# EAGLE design Kintex7_disp_inout_hdmi (EAGLE 7.6.0)

## Sheet 1 of 3
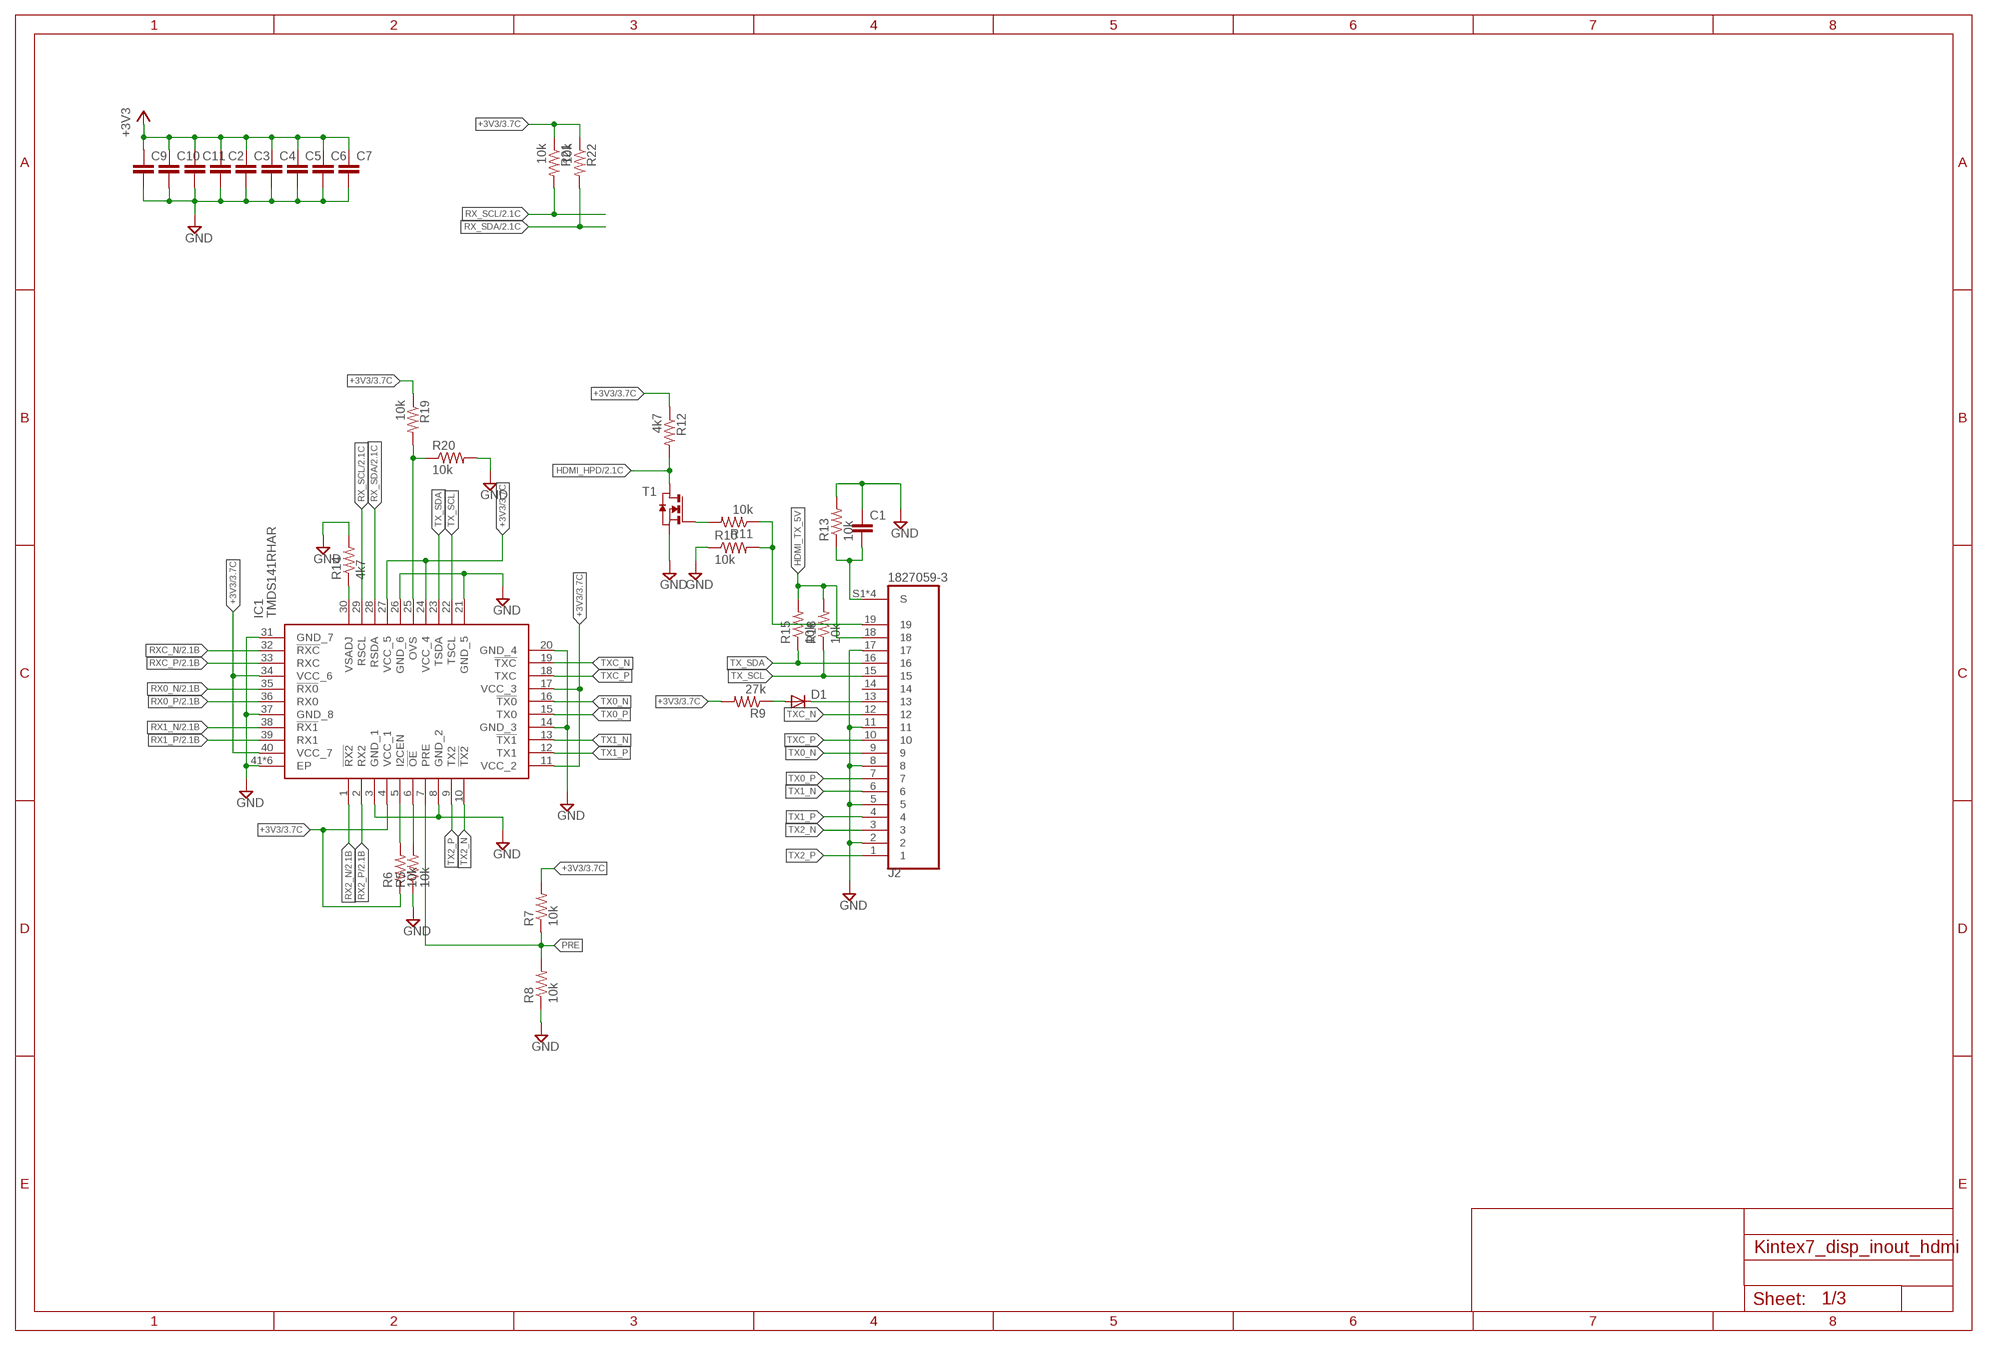
[diagram p0: schematic, sheet 1]

### Parts
C1  C-EUC0603  [C0603]
C2  C-EUC0603  [C0603]
C3  C-EUC0603  [C0603]
C4  C-EUC0603  [C0603]
C5  C-EUC0603  [C0603]
C6  C-EUC0603  [C0603]
C7  C-EUC0603  [C0603]
C9  C-EUC0603  [C0603]
C10  C-EUC0603  [C0603]
C11  C-EUC0603  [C0603]
D1  DIODE-MINIMELF  [MINIMELF]
IC1  TMDS141RHAR  [QFN50P600X600X100-41N]
J2  1827059-3  [TE_1827059-3]
R5  10k  R-US_R0805  [R0805]
R6  10k  R-US_R0805  [R0805]
R7  10k  R-US_R0805  [R0805]
R8  10k  R-US_R0805  [R0805]
R9  27k  R-US_R0805  [R0805]
R10  10k  R-US_R0805  [R0805]
R11  10k  R-US_R0805  [R0805]
R12  4k7  R-US_R0805  [R0805]
R13  10k  R-US_R0805  [R0805]
R14  4k7  R-US_R0805  [R0805]
R15  10k  R-US_R0805  [R0805]
R18  10k  R-US_R0805  [R0805]
R19  10k  R-US_R0805  [R0805]
R20  10k  R-US_R0805  [R0805]
R21  10k  R-US_R0805  [R0805]
R22  10k  R-US_R0805  [R0805]
T1  NMOSSOT23  [SOT-23]

### Nets
+3V3: C2.1 C3.1 C4.1 C5.1 C6.1 C7.1 C9.1 C10.1 C11.1 IC1.4(VCC_1) IC1.11(VCC_2) IC1.17(VCC_3) IC1.24(VCC_4) IC1.27(VCC_5) IC1.34(VCC_6) IC1.40(VCC_7) R6.1 R7.2 R9.2 R12.1 R19.1 R21.1 R22.1 ; also sheet 2,3
GND: C1.1 C2.2 C3.2 C4.2 C5.2 C6.2 C7.2 C9.2 C10.2 C11.2 IC1.3(GND_1) IC1.8(GND_2) IC1.14(GND_3) IC1.20(GND_4) IC1.21(GND_5) IC1.26(GND_6) IC1.31(GND_7) IC1.37(GND_8) IC1.41(EP) IC1.P$1(EP) IC1.P$2(EP) IC1.P$3(EP) IC1.P$4(EP) IC1.P$5(EP) J2.2 J2.5 J2.8 J2.11 J2.17 R5.1 R8.1 R10.1 R13.2 R14.2 R20.2 T1.2(S) ; also sheet 2,3
HDMI_HPD: R12.2 T1.1(D) ; also sheet 2
HDMI_TX_5V: J2.18 R15.2 R18.2
N$1: D1.A R9.1
N$6: IC1.6(!OE) R5.2
N$7: IC1.5(I2CEN) R6.2
N$8: D1.C J2.13
N$10: IC1.25(OVS) R19.2 R20.1
N$12: R11.2 T1.3(G)
N$13: C1.2 J2.S1(S) J2.S2(S) J2.S3(S) J2.S4(S) R13.1
N$14: IC1.30(VSADJ) R14.1
N$15: J2.19 R10.2 R11.1
PRE: IC1.7(PRE) R7.1 R8.2
RX0_N: IC1.35(!RX0) ; also sheet 2
RX0_P: IC1.36(RX0) ; also sheet 2
RX1_N: IC1.38(!RX1) ; also sheet 2
RX1_P: IC1.39(RX1) ; also sheet 2
RX2_N: IC1.1(!RX2) ; also sheet 2
RX2_P: IC1.2(RX2) ; also sheet 2
RX_SCL: IC1.29(RSCL) R21.2 ; also sheet 2
RX_SDA: IC1.28(RSDA) R22.2 ; also sheet 2
RXC_N: IC1.32(!RXC) ; also sheet 2
RXC_P: IC1.33(RXC) ; also sheet 2
TX0_N: IC1.16(!TX0) J2.9
TX0_P: IC1.15(TX0) J2.7
TX1_N: IC1.13(!TX1) J2.6
TX1_P: IC1.12(TX1) J2.4
TX2_N: IC1.10(!TX2) J2.3
TX2_P: IC1.9(TX2) J2.1
TX_SCL: IC1.22(TSCL) J2.15 R18.1
TX_SDA: IC1.23(TSDA) J2.16 R15.1
TXC_N: IC1.19(!TXC) J2.12
TXC_P: IC1.18(TXC) J2.10
Unconnected: J2.14

## Sheet 2 of 3
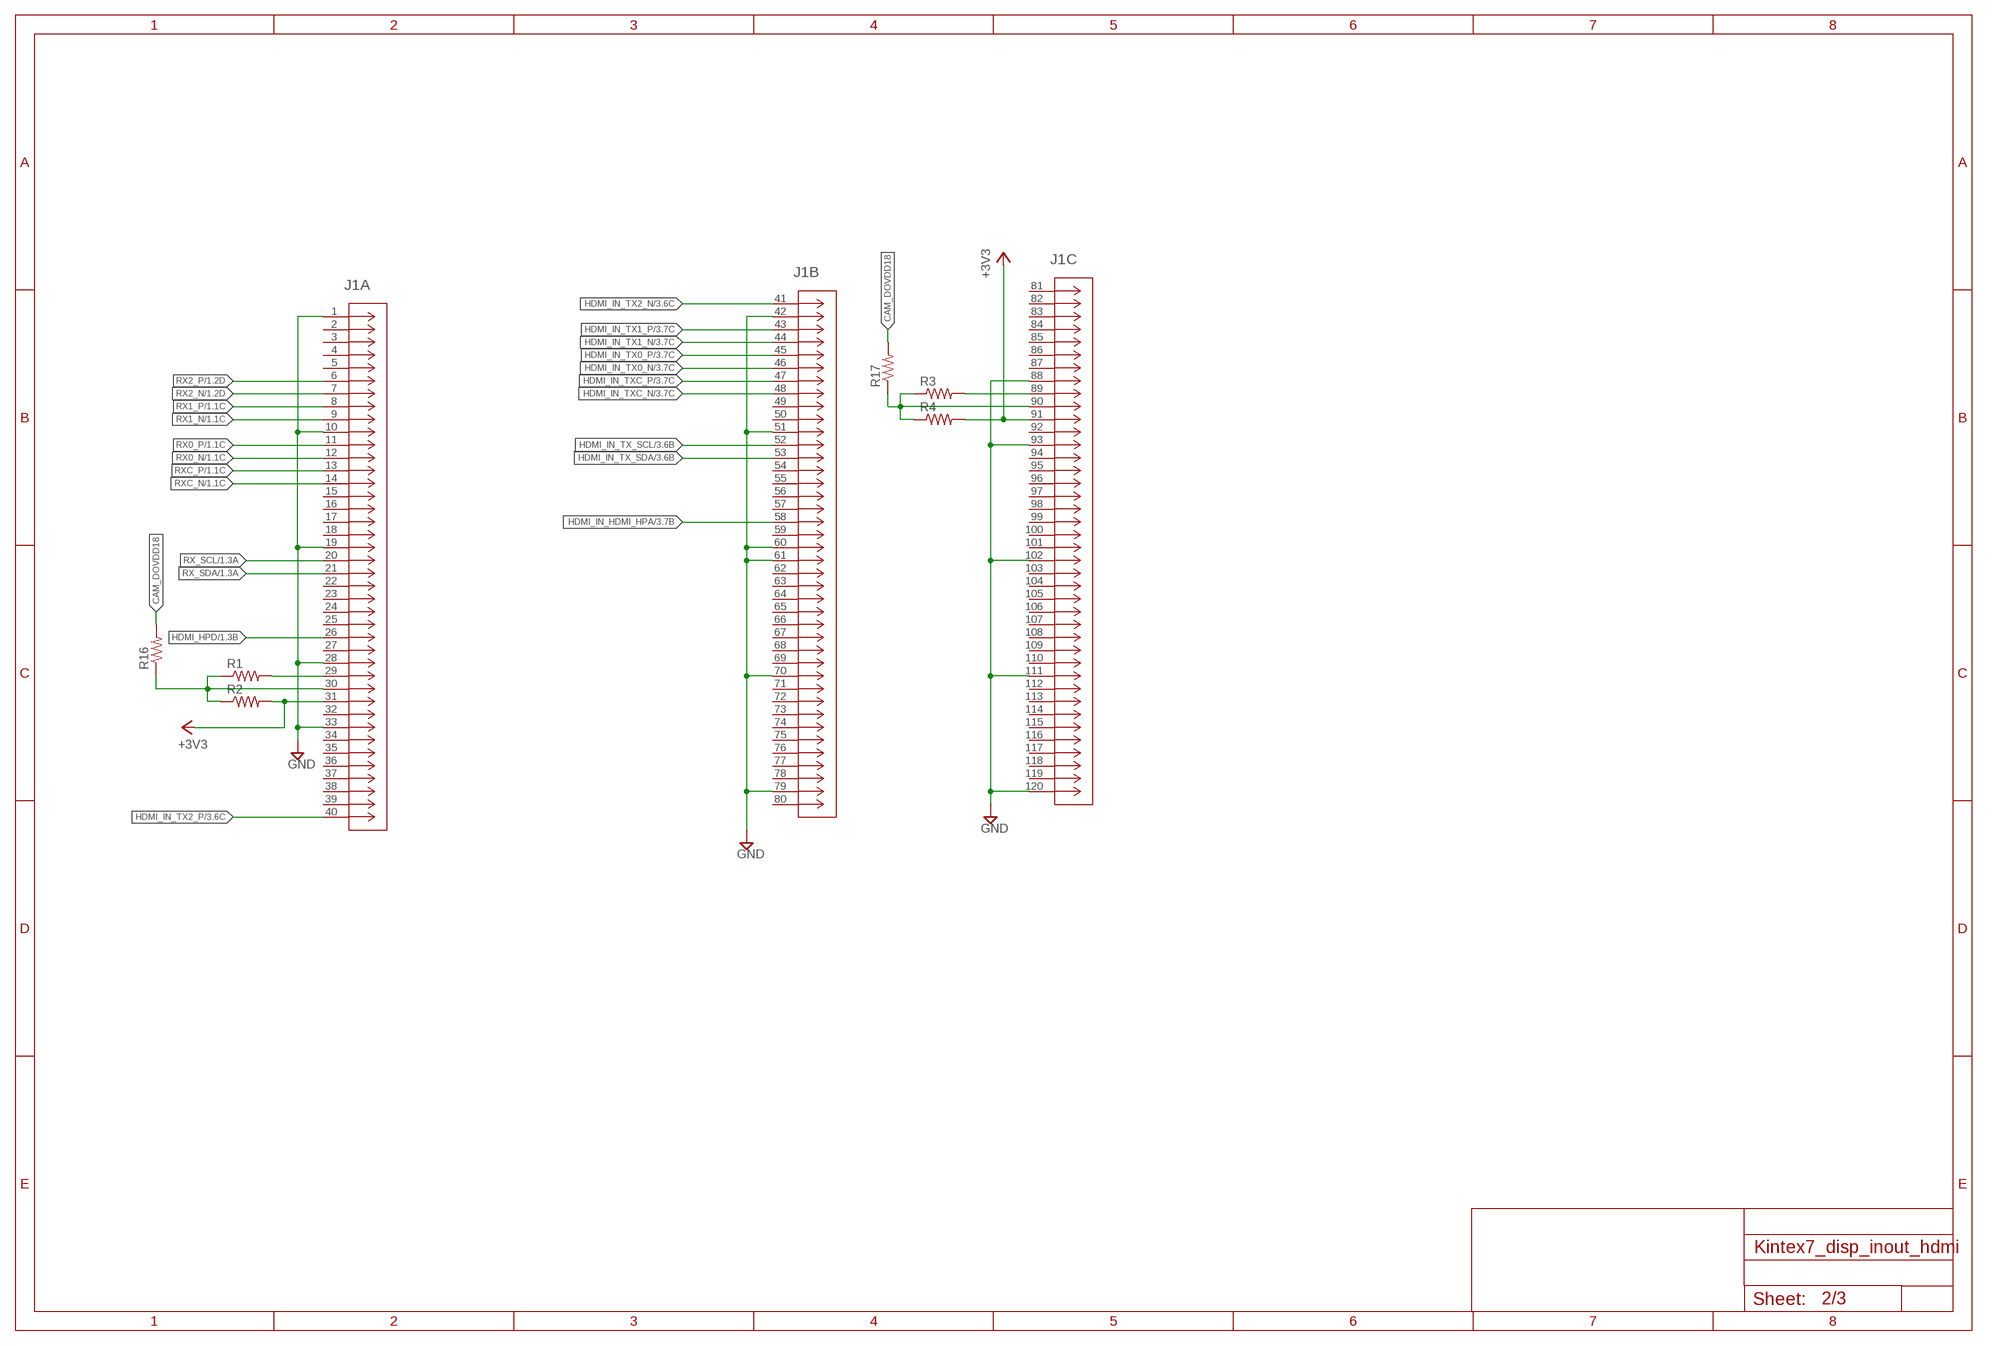
[diagram p1: schematic, sheet 2]

### Parts
J1  5177985-5  [CONN_5177985-5]
R1  R-US_R0805  [R0805]
R2  R-US_R0805  [R0805]
R3  R-US_R0805  [R0805]
R4  R-US_R0805  [R0805]
R16  R-US_R0805  [R0805]
R17  R-US_R0805  [R0805]

### Nets
+3V3: J1.31 J1.91 R2.2 R4.2 ; also sheet 1,3
CAM_DOVDD18: R16.2 R17.2
GND: J1.1 J1.10 J1.19 J1.28 J1.33 J1.42 J1.51 J1.60 J1.61 J1.70 J1.79 J1.88 J1.93 J1.102 J1.111 J1.120 ; also sheet 1,3
HDMI_HPD: J1.26 ; also sheet 1
HDMI_IN_HDMI_HPA: J1.58 ; also sheet 3
HDMI_IN_TX0_N: J1.46 ; also sheet 3
HDMI_IN_TX0_P: J1.45 ; also sheet 3
HDMI_IN_TX1_N: J1.44 ; also sheet 3
HDMI_IN_TX1_P: J1.43 ; also sheet 3
HDMI_IN_TX2_N: J1.41 ; also sheet 3
HDMI_IN_TX2_P: J1.40 ; also sheet 3
HDMI_IN_TX_SCL: J1.52 ; also sheet 3
HDMI_IN_TX_SDA: J1.53 ; also sheet 3
HDMI_IN_TXC_N: J1.48 ; also sheet 3
HDMI_IN_TXC_P: J1.47 ; also sheet 3
N$2: J1.90 R3.1 R4.1 R17.1
N$3: J1.29 R1.2
N$4: J1.89 R3.2
N$9: J1.30 R1.1 R2.1 R16.1
RX0_N: J1.12 ; also sheet 1
RX0_P: J1.11 ; also sheet 1
RX1_N: J1.9 ; also sheet 1
RX1_P: J1.8 ; also sheet 1
RX2_N: J1.7 ; also sheet 1
RX2_P: J1.6 ; also sheet 1
RX_SCL: J1.20 ; also sheet 1
RX_SDA: J1.21 ; also sheet 1
RXC_N: J1.14 ; also sheet 1
RXC_P: J1.13 ; also sheet 1
Unconnected: J1.2 J1.3 J1.4 J1.5 J1.15 J1.16 J1.17 J1.18 J1.22 J1.23 J1.24 J1.25 J1.27 J1.32 J1.34 J1.35 J1.36 J1.37 J1.38 J1.39 J1.49 J1.50 J1.54 J1.55 J1.56 J1.57 J1.59 J1.62 J1.63 J1.64 J1.65 J1.66 J1.67 J1.68 J1.69 J1.71 J1.72 J1.73 J1.74 J1.75 J1.76 J1.77 J1.78 J1.80 J1.81 J1.82 J1.83 J1.84 J1.85 J1.86 J1.87 J1.92 J1.94 J1.95 J1.96 J1.97 J1.98 J1.99 J1.100 J1.101 J1.103 J1.104 J1.105 J1.106 J1.107 J1.108 J1.109 J1.110 J1.112 J1.113 J1.114 J1.115 J1.116 J1.117 J1.118 J1.119

## Sheet 3 of 3
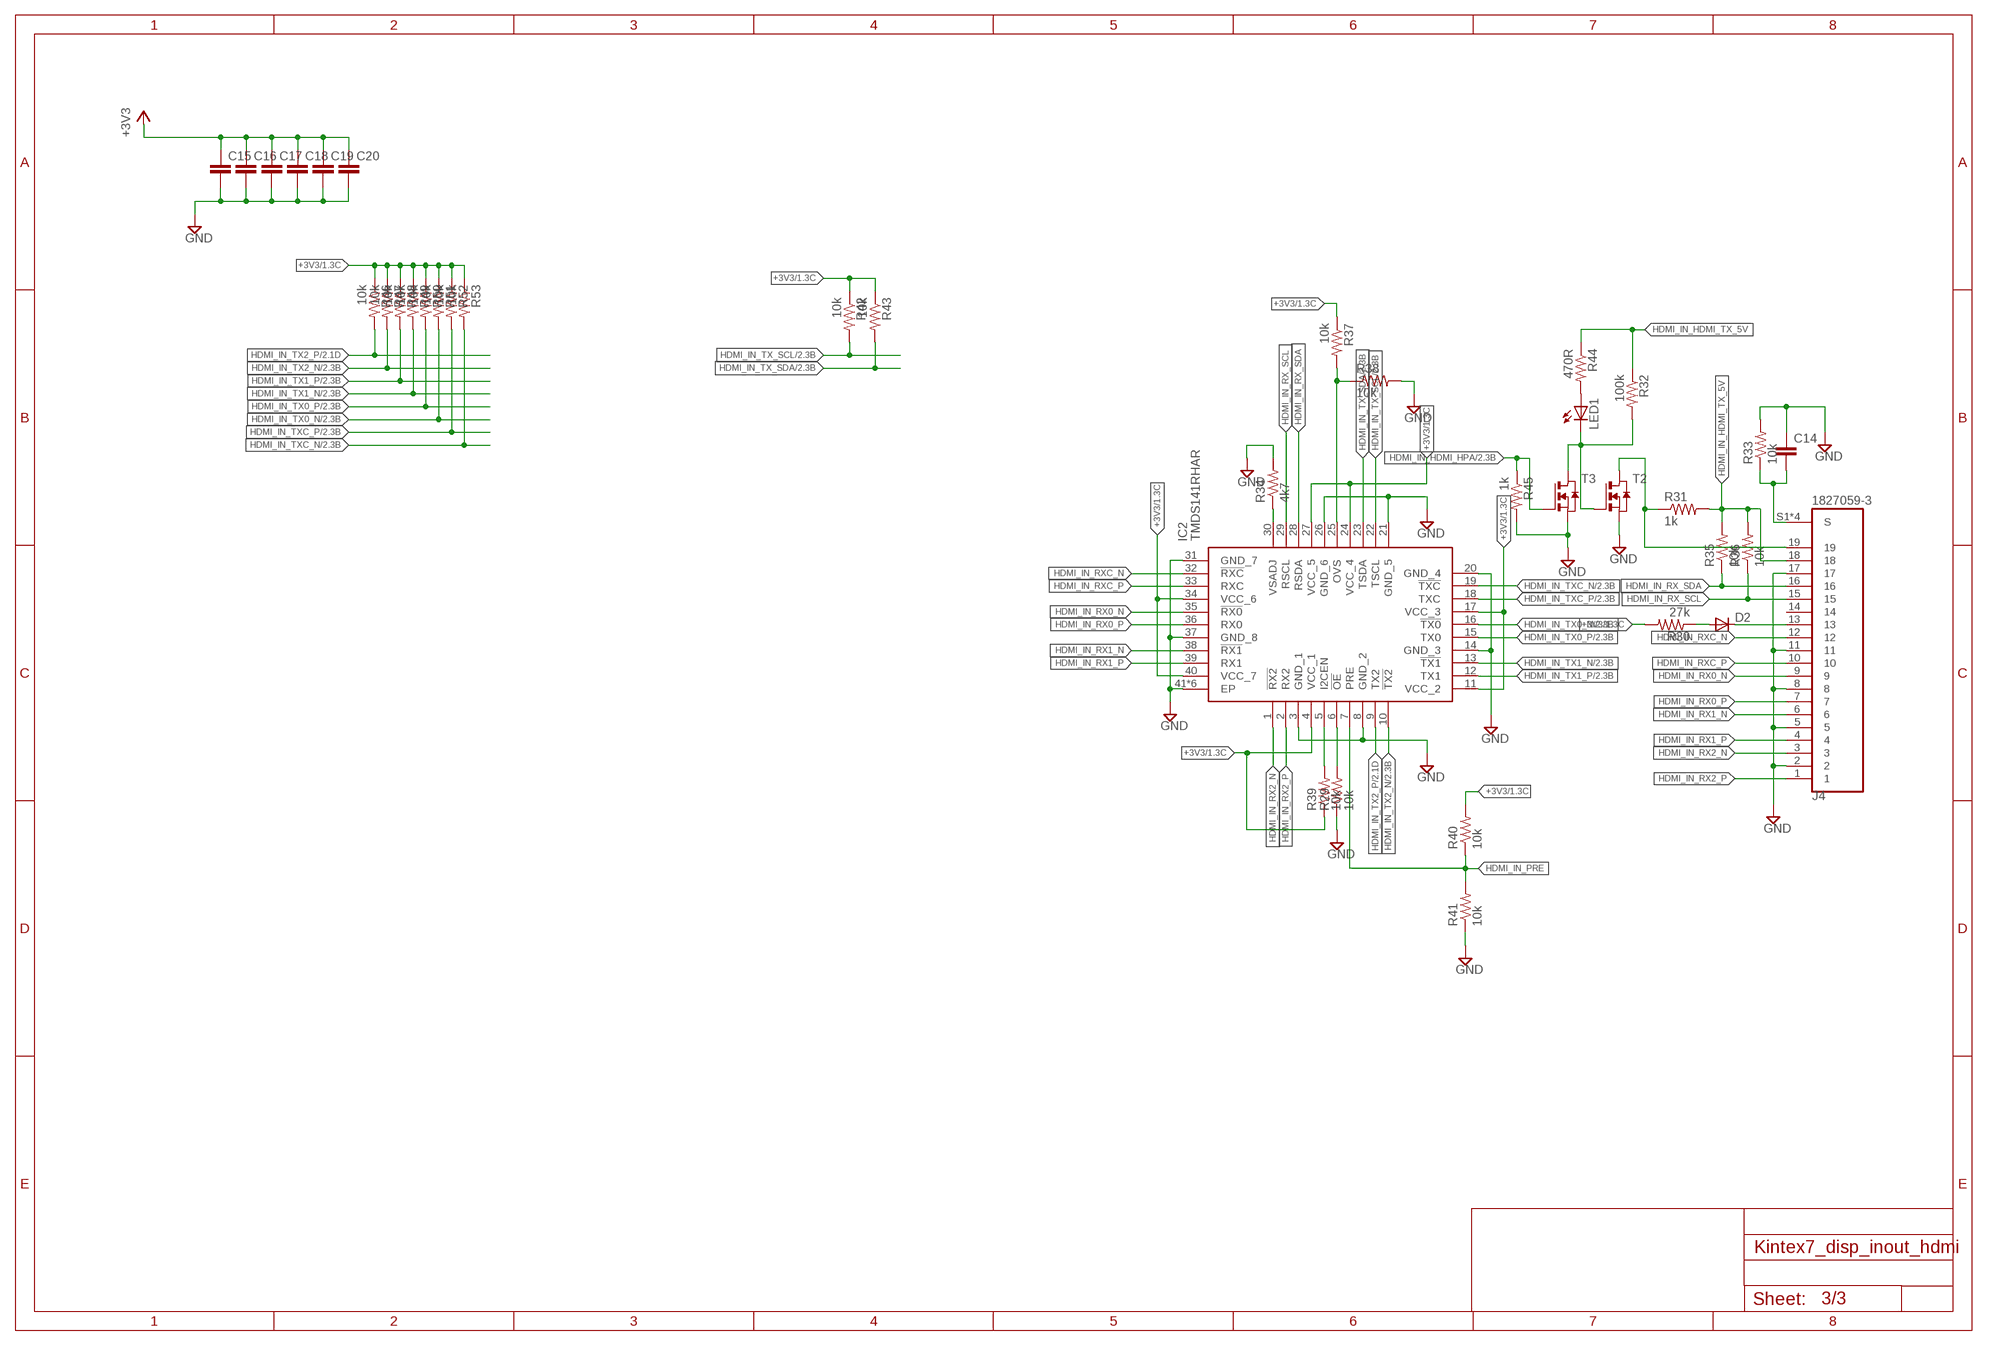
[diagram p2: schematic, sheet 3]

### Parts
C14  C-EUC0603  [C0603]
C15  C-EUC0603  [C0603]
C16  C-EUC0603  [C0603]
C17  C-EUC0603  [C0603]
C18  C-EUC0603  [C0603]
C19  C-EUC0603  [C0603]
C20  C-EUC0603  [C0603]
D2  DIODE-MINIMELF  [MINIMELF]
IC2  TMDS141RHAR  [QFN50P600X600X100-41N]
J4  1827059-3  [TE_1827059-3]
LED1  LEDCHIPLED_0603  [CHIPLED_0603]
R29  10k  R-US_R0805  [R0805]
R30  27k  R-US_R0805  [R0805]
R31  1k  R-US_R0805  [R0805]
R32  100k  R-US_R0805  [R0805]
R33  10k  R-US_R0805  [R0805]
R34  4k7  R-US_R0805  [R0805]
R35  10k  R-US_R0805  [R0805]
R36  10k  R-US_R0805  [R0805]
R37  10k  R-US_R0805  [R0805]
R38  10k  R-US_R0805  [R0805]
R39  10k  R-US_R0805  [R0805]
R40  10k  R-US_R0805  [R0805]
R41  10k  R-US_R0805  [R0805]
R42  10k  R-US_R0805  [R0805]
R43  10k  R-US_R0805  [R0805]
R44  470R  R-US_R0805  [R0805]
R45  1k  R-US_R0805  [R0805]
R46  10k  R-US_R0805  [R0805]
R47  10k  R-US_R0805  [R0805]
R48  10k  R-US_R0805  [R0805]
R49  10k  R-US_R0805  [R0805]
R50  10k  R-US_R0805  [R0805]
R51  10k  R-US_R0805  [R0805]
R52  10k  R-US_R0805  [R0805]
R53  10k  R-US_R0805  [R0805]
T2  NMOSSOT23  [SOT-23]
T3  NMOSSOT23  [SOT-23]

### Nets
+3V3: C15.1 C16.1 C17.1 C18.1 C19.1 C20.1 IC2.4(VCC_1) IC2.11(VCC_2) IC2.17(VCC_3) IC2.24(VCC_4) IC2.27(VCC_5) IC2.34(VCC_6) IC2.40(VCC_7) R30.2 R37.1 R39.1 R40.2 R42.1 R43.1 R46.1 R47.1 R48.1 R49.1 R50.1 R51.1 R52.1 R53.1 ; also sheet 1,2
GND: C14.1 C15.2 C16.2 C17.2 C18.2 C19.2 C20.2 IC2.3(GND_1) IC2.8(GND_2) IC2.14(GND_3) IC2.20(GND_4) IC2.21(GND_5) IC2.26(GND_6) IC2.31(GND_7) IC2.37(GND_8) IC2.41(EP) IC2.P$1(EP) IC2.P$2(EP) IC2.P$3(EP) IC2.P$4(EP) IC2.P$5(EP) J4.2 J4.5 J4.8 J4.11 J4.17 R29.1 R33.2 R34.2 R38.2 R41.1 R45.2 T2.2(S) T3.2(S) ; also sheet 1,2
HDMI_IN_HDMI_HPA: R45.1 T3.3(G) ; also sheet 2
HDMI_IN_HDMI_TX_5V: J4.18 R31.2 R32.1 R35.2 R36.2 R44.1
HDMI_IN_PRE: IC2.7(PRE) R40.1 R41.2
HDMI_IN_RX0_N: IC2.35(!RX0) J4.9
HDMI_IN_RX0_P: IC2.36(RX0) J4.7
HDMI_IN_RX1_N: IC2.38(!RX1) J4.6
HDMI_IN_RX1_P: IC2.39(RX1) J4.4
HDMI_IN_RX2_N: IC2.1(!RX2) J4.3
HDMI_IN_RX2_P: IC2.2(RX2) J4.1
HDMI_IN_RX_SCL: IC2.29(RSCL) J4.15 R36.1
HDMI_IN_RX_SDA: IC2.28(RSDA) J4.16 R35.1
HDMI_IN_RXC_N: IC2.32(!RXC) J4.12
HDMI_IN_RXC_P: IC2.33(RXC) J4.10
HDMI_IN_TX0_N: IC2.16(!TX0) R51.2 ; also sheet 2
HDMI_IN_TX0_P: IC2.15(TX0) R50.2 ; also sheet 2
HDMI_IN_TX1_N: IC2.13(!TX1) R49.2 ; also sheet 2
HDMI_IN_TX1_P: IC2.12(TX1) R48.2 ; also sheet 2
HDMI_IN_TX2_N: IC2.10(!TX2) R47.2 ; also sheet 2
HDMI_IN_TX2_P: IC2.9(TX2) R46.2 ; also sheet 2
HDMI_IN_TX_SCL: IC2.22(TSCL) R42.2 ; also sheet 2
HDMI_IN_TX_SDA: IC2.23(TSDA) R43.2 ; also sheet 2
HDMI_IN_TXC_N: IC2.19(!TXC) R53.2 ; also sheet 2
HDMI_IN_TXC_P: IC2.18(TXC) R52.2 ; also sheet 2
N$42: IC2.6(!OE) R29.2
N$43: D2.A R30.1
N$44: D2.C J4.13
N$45: C14.2 J4.S1(S) J4.S2(S) J4.S3(S) J4.S4(S) R33.1
N$46: IC2.30(VSADJ) R34.1
N$47: J4.19 R31.1 T2.1(D)
N$48: IC2.25(OVS) R37.2 R38.1
N$49: IC2.5(I2CEN) R39.2
N$50: LED1.C R32.2 T2.3(G) T3.1(D)
N$51: LED1.A R44.2
Unconnected: J4.14

## Library data of the parts
C1-C7 C9-C11 C14-C20 = resistor:C-EU: CAPACITOR, European symbol
D1 D2 = diode:DIODE-: DIODE
IC1 IC2 = TMDS141RHAR:TMDS141RHAR: HDMI Hider Source: Datasheet <http://uk.rs-online.com/web/p/products/8124195P>; DESCRIPTION: HDMI Hider; HEIGHT: 1mm; MANUFACTURER_NAME: Texas Instruments; MANUFACTURER_PART_NUMBER: TMDS141RHAR; RS_PART_NUMBER: 8124195P; RS_PRICE-STOCK: http://uk.rs-online.com/web/p/products/8124195P
J1 = te_con:5177985-5; BUILT_BY: EMA_UL_Team; MANUFACTURER_PART_NUMBER: 5177985-5; VENDOR: TE Connectivity
J2 J4 = 1827059-3:1827059-3: Emboss Package Hdmi Conn Smt No-Flange t; AVAILABILITY: Unavailable; COMMENT: 1827059-3; DESCRIPTION: EMBOSS PACKAGE HDMI CONN SMT NO-FLANGE T; EU_ROHS_COMPLIANCE: Compliant; MF: TE Connectivity; MP: 1827059-3; PACKAGE: None; PRICE: None; TE_PURCHASE_URL: https://www.te.com/usa-en/product-1827059-3.html?te_bu=Cor&te_type=disp&te_campaign=seda_glo_cor-seda-global-disp-prtnr-fy19-seda-model-bom-cta_sma-317_1&elqCampaignId=32493
LED1 = led:LED: LED OSRAM: - CHIPLED LG R971, LG N971, LY N971, LG Q971, LY Q971, LO R971, LY R971 LH N974, LH R974 LS Q976, LO Q976, LY Q976 LO Q996 - Hyper CHIPLED LW Q18S LB Q993, LB Q99A, LB R99A - SideLED LS A670, LO A670, LY A670, LG A670, LP A670 LB A673, LV A673, LT A673, LW A673 LH A674 LY A675 LS A676, LA A676, LO A676, LY A676, LW A676 LS A679, LY A679, LG A679 - Hyper Micro SIDELED® LS Y876, LA Y876, LO Y876, LY Y876 LT Y87S - SmartLED LW L88C, LW L88S LB L89C, LB L89S, LG L890 LS L89K, LO L89K, LY L89K LS L896, LA L896, LO L896, LY L896 - TOPLED LS T670, LO T670, LY T670, LG T670, LP T670 LSG T670, LSP T670, LSY T670, LOP T670, LYG T670 LG T671, LOG T671, LSG T671 LB T673, LV T673, LT T673, LW T673 LH T674 LS T676, LA T676, LO T676, LY T676, LB T676, LH T676, LSB T676, LW T676 LB T67C, LV T67C, LT T67C, LS T67K, LO T67K, LY T67K, LW E67C LS E67B, LA E67B, LO E67B, LY E67B, LB E67C, LV E67C, LT E67C LW T67C LS T679, LY T679, LG T679 LS T770, LO T770, LY T770, LG T770, LP T770 LB T773, LV T773, LT T773, LW T773 LH T774 LS E675, LA E675, LY E675, LS T675 LS T776, LA T776, LO T776, LY T776, LB T776 LHGB T686 LT T68C, LB T68C - Hyper Mini TOPLED® LB M676 - Mini TOPLED Santana® LG M470 LS M47K, LO M47K, LY M47K Source: http://www.osram.convergy.de LUXEON: - LUMILED® LXK2-PW12-R00, LXK2-PW12-S00, LXK2-PW14-U00, LXK2-PW14-V00 LXK2-PM12-R00, LXK2-PM12-S00, LXK2-PM14-U00 LXK2-PE12-Q00, LXK2-PE12-R00, LXK2-PE12-S00, LXK2-PE14-T00, LXK2-PE14-U00 LXK2-PB12-K00, LXK2-PB12-L00, LXK2-PB12-M00, LXK2-PB14-N00, LXK2-PB14-P00, LXK2-PB14-Q00 LXK2-PR12-L00, LXK2-PR12-M00, LXK2-PR14-Q00, LXK2-PR14-R00 LXK2-PD12-Q00, LXK2-PD12-R00, LXK2-PD12-S00 LXK2-PH12-R00, LXK2-PH12-S00 LXK2-PL12-P00, LXK2-PL12-Q00, LXK2-PL12-R00 Source: www.luxeon.com KINGBRIGHT: KA-3528ASYC Source: www.kingbright.com
R1-R22 R29-R53 = rcl:R-US_: RESISTOR, American symbol
T1-T3 = zetex:NMOSSOT23: MOS FET; OC_FARNELL: unknown; OC_NEWARK: unknown

## Board
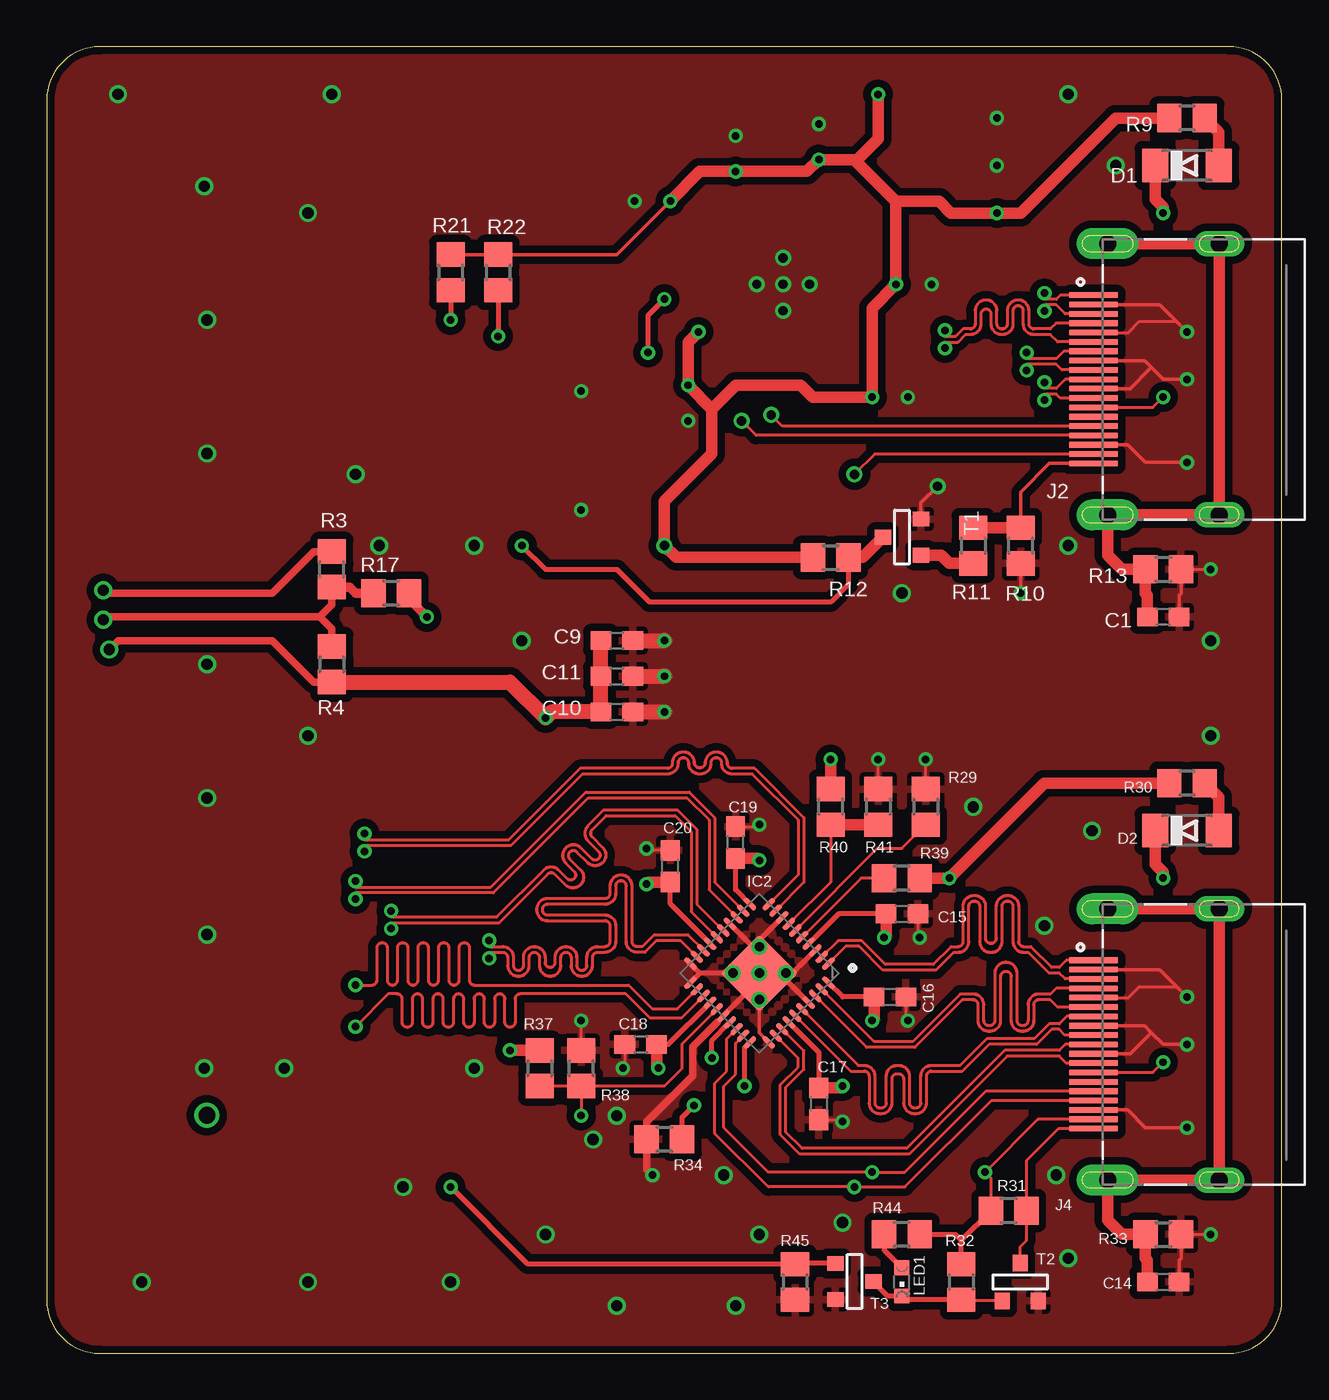
[diagram p3: board, top side]
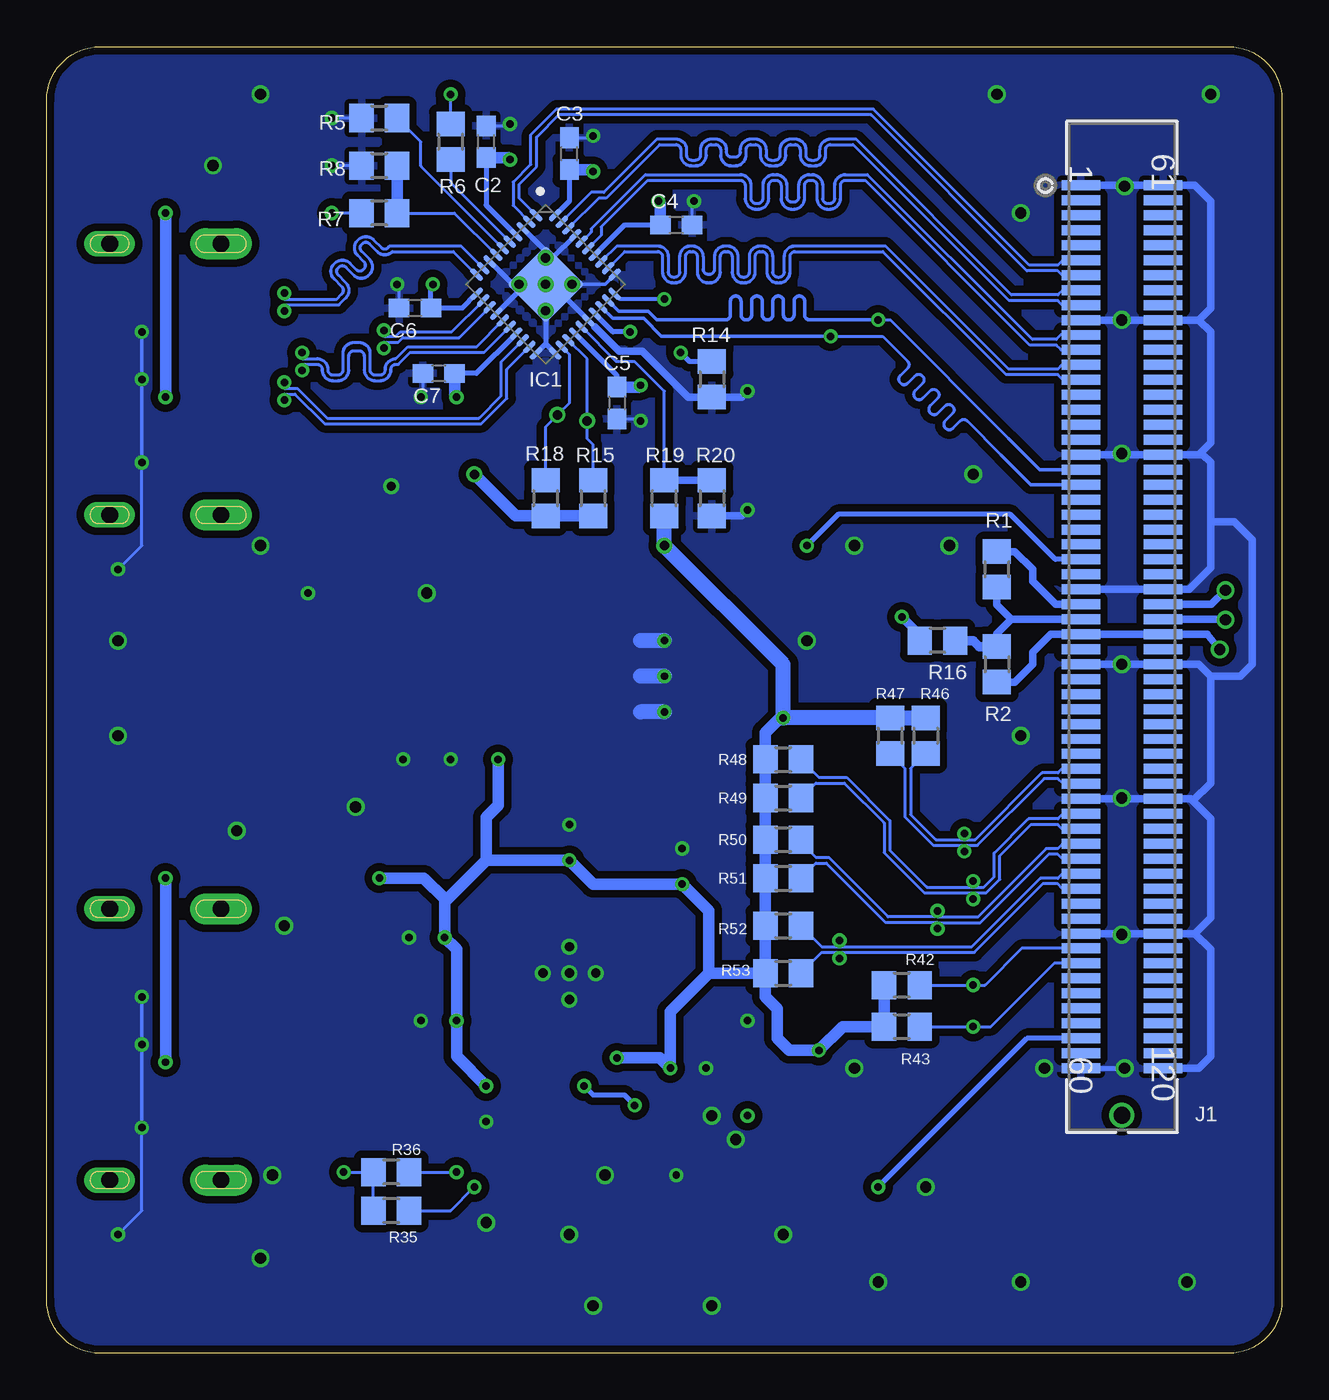
[diagram p4: board, bottom side, seen from below]

Size 66.04 x 69.85 mm. Coordinates in mm from the lower left corner, seen from the top.
Outline: 63.2,69.85 2.84,69.85 arc90 0,67.01 0,2.84 arc90 2.84,0 63.2,0 arc90 66.04,2.84 66.04,67.01 arc90 63.2,69.85
Copper layers (1*16): Top 0.035mm / dielectric 1.5mm / Bottom 0.035mm
Design rules "2side *": minimum track width 6mil, minimum drill 0.4mm, track to track 6mil, track to pad 6mil, pad to pad 6mil, via to via 6mil, smd to smd 6mil, copper to edge 10mil, drill to drill 10mil, minimum pad ring 7mil, minimum via ring 7mil, stop-mask expansion 1mil, vias tented up to drill 0.8mm, thermal gap 10mil

### Footprints (pad centres in the part's own frame; a part is rotated, then mirrored left to right if it is on the bottom)
C0603 = smd 1.1 x 1: 1 -0.85,0; 2 0.85,0
MINIMELF = smd 1.4 x 1.8: A 1.7,0; C -1.7,0
QFN50P600X600X100-41N = smd 0.85 x 0.28: 1 -2.975,2.25; 2 -2.975,1.75; 3 -2.975,1.25; 4 -2.975,0.75; 5 -2.975,0.25; 6 -2.975,-0.25; 7 -2.975,-0.75; 8 -2.975,-1.25; 9 -2.975,-1.75; 10 -2.975,-2.25; 21 2.975,-2.25; 22 2.975,-1.75; 23 2.975,-1.25; 24 2.975,-0.75; 25 2.975,-0.25; 26 2.975,0.25; 27 2.975,0.75; 28 2.975,1.25; 29 2.975,1.75; 30 2.975,2.25 | smd 0.28 x 0.85: 11 -2.25,-2.975; 12 -1.75,-2.975; 13 -1.25,-2.975; 14 -0.75,-2.975; 15 -0.25,-2.975; 16 0.25,-2.975; 17 0.75,-2.975; 18 1.25,-2.975; 19 1.75,-2.975; 20 2.25,-2.975; 31 2.25,2.975; 32 1.75,2.975; 33 1.25,2.975; 34 0.75,2.975; 35 0.25,2.975; 36 -0.25,2.975; 37 -0.75,2.975; 38 -1.25,2.975; 39 -1.75,2.975; 40 -2.25,2.975 | smd 2.9 x 2.9: 41 0,0 | drill 0.5 pad 0.8: P$1 -1,1; P$2 1,1; P$3 0,0; P$4 -1,-1; P$5 1,-1
CONN_5177985-5 = smd 0.533 x 2.057: 1 -47.2,-4.4; 2 -46.4,-4.4; 3 -45.6,-4.4; 4 -44.8,-4.4; 5 -44,-4.4; 6 -43.2,-4.4; 7 -42.4,-4.4; 8 -41.6,-4.4; 9 -40.8,-4.4; 10 -40,-4.4; 11 -39.2,-4.4; 12 -38.4,-4.4; 13 -37.6,-4.4; 14 -36.8,-4.4; 15 -36,-4.4; 16 -35.2,-4.4; 17 -34.4,-4.4; 18 -33.6,-4.4; 19 -32.8,-4.4; 20 -32,-4.4; 21 -31.2,-4.4; 22 -30.4,-4.4; 23 -29.6,-4.4; 24 -28.8,-4.4; 25 -28,-4.4; 26 -27.2,-4.4; 27 -26.4,-4.4; 28 -25.6,-4.4; 29 -24.8,-4.4; 30 -24,-4.4; 31 -23.2,-4.4; 32 -22.4,-4.4; 33 -21.6,-4.4; 34 -20.8,-4.4; 35 -20,-4.4; 36 -19.2,-4.4; 37 -18.4,-4.4; 38 -17.6,-4.4; 39 -16.8,-4.4; 40 -16,-4.4; 41 -15.2,-4.4; 42 -14.4,-4.4; 43 -13.6,-4.4; 44 -12.8,-4.4; 45 -12,-4.4; 46 -11.2,-4.4; 47 -10.4,-4.4; 48 -9.6,-4.4; 49 -8.8,-4.4; 50 -8,-4.4; 51 -7.2,-4.4; 52 -6.4,-4.4; 53 -5.6,-4.4; 54 -4.8,-4.4; 55 -4,-4.4; 56 -3.2,-4.4; 57 -2.4,-4.4; 58 -1.6,-4.4; 59 -0.8,-4.4; 60 0,-4.4; 61 -47.2,0; 62 -46.4,0; 63 -45.6,0; 64 -44.8,0; 65 -44,0; 66 -43.2,0; 67 -42.4,0; 68 -41.6,0; 69 -40.8,0; 70 -40,0; 71 -39.2,0; 72 -38.4,0; 73 -37.6,0; 74 -36.8,0; 75 -36,0; 76 -35.2,0; 77 -34.4,0; 78 -33.6,0; 79 -32.8,0; 80 -32,0; 81 -31.2,0; 82 -30.4,0; 83 -29.6,0; 84 -28.8,0; 85 -28,0; 86 -27.2,0; 87 -26.4,0; 88 -25.6,0; 89 -24.8,0; 90 -24,0; 91 -23.2,0; 92 -22.4,0; 93 -21.6,0; 94 -20.8,0; 95 -20,0; 96 -19.2,0; 97 -18.4,0; 98 -17.6,0; 99 -16.8,0; 100 -16,0; 101 -15.2,0; 102 -14.4,0; 103 -13.6,0; 104 -12.8,0; 105 -12,0; 106 -11.2,0; 107 -10.4,0; 108 -9.6,0; 109 -8.8,0; 110 -8,0; 111 -7.2,0; 112 -6.4,0; 113 -5.6,0; 114 -4.8,0; 115 -4,0; 116 -3.2,0; 117 -2.4,0; 118 -1.6,0; 119 -0.8,0; 120 0,0 | drill 0.889 pad 0.889: 121 2.515,-2.21
TE_1827059-3 = smd 0.3 x 2.6: 1 4.5,5; 2 4,5; 3 3.5,5; 4 3,5; 5 2.5,5; 6 2,5; 7 1.5,5; 8 1,5; 9 0.5,5; 10 0,5; 11 -0.5,5; 12 -1,5; 13 -1.5,5; 14 -2,5; 15 -2.5,5; 16 -3,5; 17 -3.5,5; 18 -4,5; 19 -4.5,5 | drill 0.9 pad 1.65 long: S1 7.25,4.24; S2 -7.25,4.24 | drill 0.9 pad 1.35 long: S3 -7.25,-1.72; S4 7.25,-1.72
CHIPLED_0603 = smd 0.8 x 0.8: A 0,-0.75; C 0,0.75
R0805 = smd 1.3 x 1.5: 1 -0.95,0; 2 0.95,0
SOT-23 = smd 0.787 x 0.889: 1 0.025,-1.016; 2 -0.94,1.016; 3 0.991,1.016

### Placement (x,y rotation side)
C1  59.69,39.37 180 top
C2  42.55,64.77 90 bottom
C3  38.1,64.14 90 bottom
C4  32.38,60.33 0 bottom
C5  35.56,50.8 270 bottom
C6  46.35,55.88 180 bottom
C7  45.09,52.39 180 bottom
C9  30.48,38.1 0 top
C10  30.48,34.29 0 top
C11  30.48,36.2 0 top
C14  59.69,3.81 180 top
C15  45.72,23.5 0 top
C16  45.09,19.05 0 top
C17  41.27,13.34 270 top
C18  31.75,16.51 180 top
C19  36.83,27.3 90 top
C20  33.34,26.04 90 top
D1  60.96,63.5 0 top
D2  60.96,27.94 0 top
IC1  39.37,57.15 315 bottom
IC2  38.1,20.32 225 top
J1  6.35,15.24 270 bottom
J2  60.96,52.07 90 top
J4  60.96,16.51 90 top
LED1  45.72,3.81 180 top
R1  15.24,41.91 90 bottom
R2  15.24,36.83 270 bottom
R3  15.24,41.91 90 top
R4  15.24,36.83 270 top
R5  48.26,66.04 0 bottom
R6  44.45,64.77 270 bottom
R7  48.26,60.96 180 bottom
R8  48.26,63.5 0 bottom
R9  60.96,66.04 180 top
R10  52.07,43.18 90 top
R11  49.53,43.18 270 top
R12  41.91,42.55 0 top
R13  59.69,41.91 0 top
R14  30.48,52.07 270 bottom
R15  36.83,45.72 270 bottom
R16  18.41,38.1 180 bottom
R17  18.41,40.64 0 top
R18  39.37,45.72 270 bottom
R19  33.02,45.72 90 bottom
R20  30.48,45.72 270 bottom
R21  21.59,57.78 270 top
R22  24.13,57.78 270 top
R29  46.99,29.21 270 top
R30  60.96,30.48 180 top
R31  51.44,7.62 180 top
R32  48.9,3.81 270 top
R33  59.69,6.35 0 top
R34  33.02,11.43 180 top
R35  47.62,7.62 180 bottom
R36  47.62,9.68 180 bottom
R37  26.35,15.24 270 top
R38  28.57,15.24 90 top
R39  45.72,25.4 180 top
R40  41.91,29.21 90 top
R41  44.45,29.21 270 top
R42  20.32,19.68 0 bottom
R43  20.32,17.46 0 bottom
R44  45.72,6.35 180 top
R45  40.01,3.81 270 top
R46  19.05,33.02 270 bottom
R47  20.95,33.02 270 bottom
R48  26.67,31.75 0 bottom
R49  26.67,29.69 0 bottom
R50  26.67,27.46 0 bottom
R51  26.67,25.4 0 bottom
R52  26.67,22.86 0 bottom
R53  26.67,20.32 0 bottom
T1  45.72,43.66 270 top
T2  52.07,3.81 180 top
T3  43.18,3.81 90 top

### Tracks (layer width: path | path; a pad name or v marks a point on that pad's centre or on a via)
+3V3  (via drill 0.4, 0.5, 0.6)
  Top 0.152: 42.44,14.19 v42.55,14.29
  Top 0.178: v33.34,61.59 30.48,58.73 R22.1 R21.1
  Top 0.254: IC2.17 33.34,24.02 C20.1 | C15.1 42.34,23.5 IC2.4 | IC2.34 41.27,16.08 C17.1 | C16.1 42.55,19.05 IC2.40 | C18.1 33.23,16.51 IC2.24 | IC2.11 36.83,24.77 C19.1 | v35.56,15.8 35.56,16.72 IC2.27
  Top 0.406: v3.33,37.62 3.81,38.1 12.06,38.1 14.29,35.88 R2.2
  Top 0.61: v33.34,61.59 34.92,63.18 v36.83,63.18 40.64,63.18 v41.27,63.82 43.18,63.82 | R9.2 57.15,66.04 52.07,60.96 v50.8,60.96 48.34,60.96 47.7,61.59 45.4,61.59 | 45.4,61.59 v45.4,57.15 44.13,55.88 v44.13,51.12 40.96,51.12 40.32,51.75 36.83,51.75 35.56,50.48 | 43.18,63.82 43.34,63.82 44.45,64.93 v44.45,67.31 | 45.4,61.59 43.18,63.82 | 35.56,50.48 35.56,48.1 33.02,45.56 v33.02,43.18 33.66,42.55 R12.1 | v34.85,54.61 34.29,54.05 v34.29,51.75 35.56,50.48 | C20.1 32.17,25.18 v32.07,25.08 | R39.1 v48.26,25.4 53.34,30.48 R30.2 | R40.2 v41.91,31.75 | C15.1 44.87,22.33 v44.77,22.23 | C17.1 42.44,14.19 | C16.1 44.23,17.88 v44.13,17.78 | C18.1 32.6,15.34 v32.7,15.24 | C19.1 38,26.45 v38.1,26.35 | v24.77,16.19 R37.1
  Top 0.813: R2.2 24.76,35.88 v26.67,33.97 26.99,34.29 C10.1 C11.1 C9.1
  Bottom 0.152: R6.1 v44.45,67.31 | R7.2 v50.8,60.96 | 33.23,61.49 v33.34,61.59
  Bottom 0.254: IC1.17 43.07,52.39 C7.1 | C2.1 42.55,61.39 IC1.4 | IC1.34 35.13,60.33 C4.1 | C3.1 38.1,61.6 IC1.40 | C5.1 35.56,52.28 IC1.24 | IC1.11 43.82,55.88 C6.1 45.51,57.05 v45.4,57.15 | v34.85,54.61 35.77,54.61 IC1.27
  Bottom 0.406: R2.2 14.29,35.88 13.34,36.83 13.34,37.47 12.36,38.44 J1.31 J1.91 3.99,38.44 v3.33,37.62
  Bottom 0.61: C7.1 44.23,51.22 v44.13,51.12 | C2.1 41.38,63.92 v41.27,63.82 | C4.1 33.23,61.49 | C3.1 36.93,63.28 v36.83,63.18 | C5.1 34.39,51.65 v34.29,51.75 | v42.55,14.29 44.13,15.88 v44.13,17.78 44.13,21.59 v44.77,22.23 44.77,24.13 | 42.55,26.35 v38.1,26.35 36.83,25.08 v32.07,25.08 30.64,23.65 30.64,20.32 | 44.77,24.13 44.77,24.29 45.88,25.4 v48.26,25.4 | 42.55,26.35 44.77,24.13 | 42.55,26.35 42.55,28.65 41.91,29.29 v41.91,31.75 | v35.56,15.8 33.26,15.8 v32.7,15.24 32.7,18.26 30.64,20.32 | R42.1 R43.1 23.5,17.46 v24.77,16.19 R37.1 26.99,16.83 26.99,18.41 27.62,19.05 R53.1 | R53.1 R52.1 R51.1 R50.1 R49.1 R48.1 27.62,33.18 26.83,33.97 v26.67,33.97 | R53.1 30.64,20.32
  Bottom 0.813: R19.1 v33.02,43.18 26.67,36.83 v26.67,33.97 R47.1 R46.1
CAM_DOVDD18  (via drill 0.4)
  Top 0.178: R17.2 19.36,40.33
  Top 0.508: 19.36,40.33 v20.32,39.37
  Bottom 0.178: R16.2 19.36,38.41
  Bottom 0.508: 19.36,38.41 v20.32,39.37
GND  (via drill 0.4, 0.5, 0.6)
  Top 0.152: R13.2 v62.23,41.91 | J2.5 57.82,54.57 58.42,55.17 60.4,55.17 60.6,54.97 | C20.2 32.17,26.89 v32.07,26.99 | R41.1 v44.45,31.75 | R29.1 v46.99,31.75 | C15.2 46.57,22.33 v46.67,22.23 | C17.2 42.44,12.48 v42.55,12.38 | C16.2 45.94,17.88 v46.04,17.78 | C18.2 30.9,15.34 v30.8,15.24 | R33.2 v62.23,6.35 | C19.2 38,28.16 v38.1,28.26 | J4.5 57.82,19.01 58.42,19.61 60.4,19.61 60.6,19.41 | R38.2 v28.57,17.78
  Top 0.178: J2.2 59.5,56.07 60.6,54.97 v60.96,54.61 | J2.8 58.69,53.07 59.05,52.7 | 59.05,52.7 59.69,52.07 v60.96,52.07 | J2.11 57.92,51.57 59.05,52.7 | J2.17 57.79,48.57 58.74,47.62 v60.96,47.62 | C1.1 60.54,40.54 60.64,40.64 R13.2 | T1.2 46.74,45.47 v47.62,46.35 | R10.1 v52.07,40.64 | J4.2 59.5,20.51 60.6,19.41 v60.96,19.05 | J4.8 58.69,17.51 59.05,17.14 | 59.05,17.14 59.69,16.51 v60.96,16.51 | J4.11 57.92,16.01 59.05,17.14 | J4.17 57.79,13.01 58.74,12.06 v60.96,12.06 | C14.1 60.54,4.98 60.64,5.08 R33.2 | 37.75,21.73 IC2.P$4 38.1,22.09 | IC2.P$5 34.92,20.32 | 39.87,20.32 IC2.P$1 39.51,19.97 | IC2.P$2 38.1,17.14 IC2.31 | IC2.P$3 38.1,19.97 | 35.83,17.7 IC2.26
  Top 0.254: 37.75,21.73 IC2.14 | 38.1,22.09 IC2.8 | 34.92,20.32 IC2.20 | IC2.P$5 34.92,20.32 | 34.92,20.32 IC2.21 | 39.87,20.32 IC2.3 | 39.51,19.97 IC2.37 | 38.1,19.97 IC2.26
  Top 0.406: v32.38,9.53 32.07,9.84 R34.2 32.07,12.38 34.53,14.84 34.53,16.39 35.83,17.7
  Top 0.813: C10.2 v33.02,34.29 | C11.2 v33.02,36.2 | C9.2 v33.02,38.1
  Bottom 0.152: C7.2 45.94,51.22 v46.04,51.12 | R8.1 v50.8,63.5 | R5.1 v50.8,66.04 | C2.2 41.38,65.62 v41.27,65.72 | C4.2 31.54,61.49 v31.43,61.59 | C3.2 36.93,64.98 v36.83,65.09 | C5.2 34.39,49.95 v34.29,49.85 | v62.23,41.91 60.96,43.18 v60.96,47.62 | C6.2 47.2,57.05 v47.31,57.15 | v62.23,6.35 60.96,7.62 v60.96,12.06
  Bottom 0.178: v60.96,54.61 v60.96,52.07 v60.96,47.62 | 40.78,56.8 IC1.P$4 41.14,57.15 | IC1.P$5 39.37,53.97 | 39.37,58.92 IC1.P$1 39.02,58.56 | IC1.P$2 36.19,57.15 IC1.31 | IC1.P$3 39.02,57.15 | 36.75,54.88 IC1.26 | v60.96,19.05 v60.96,16.51 v60.96,12.06
  Bottom 0.254: J1.60 v8.41,15.24 | v8.41,15.24 | 40.78,56.8 IC1.14 | 41.14,57.15 IC1.8 | 39.37,53.97 IC1.20 | IC1.P$5 39.37,53.97 | 39.37,53.97 IC1.21 | 39.37,58.92 IC1.3 | 39.02,58.56 IC1.37 | 39.02,57.15 IC1.26
  Bottom 0.406: 4.66,22.44 3.81,21.59 3.81,15.88 4.45,15.24 J1.120 | 4.76,29.53 4.88,29.64 J1.102 8.53,29.64 v8.57,29.69 8.62,29.64 J1.42 | 4.76,29.53 3.81,28.57 3.81,23.29 4.66,22.44 | J1.28 J1.88 4.96,40.84 3.81,41.99 3.81,44.45 | 3.81,36.2 3.81,30.48 4.76,29.53 | 4.45,48.04 J1.79 8.51,48.04 v8.57,48.1 8.63,48.04 J1.19 | 4.45,48.04 4.22,48.04 3.81,47.62 3.81,44.45 | 4.44,55.24 J1.70 v8.57,55.24 v8.58,55.24 J1.10 | 4.44,55.24 3.81,54.61 3.81,48.67 4.45,48.04 | 4.44,55.24 3.81,55.87 3.81,61.59 4.66,62.44 J1.61 8.36,62.44 v8.41,62.39 8.46,62.44 J1.1 | J1.33 8.58,36.84 v8.57,36.83 v8.56,36.84 J1.93 4.46,36.84 3.81,36.2 | 4.66,22.44 J1.111 8.52,22.44 v8.57,22.38 8.63,22.44 J1.51 | 3.81,44.45 2.54,44.45 1.59,43.5 1.59,36.83 2.22,36.2 3.81,36.2 | R20.2 28.89,44.77 v28.57,45.09 | v28.57,51.44 28.89,51.12 R14.2 31.75,51.12 34.21,53.58 35.45,53.58 36.75,54.88
  Bottom 0.813: v33.02,34.29 34.29,34.29 | v33.02,36.2 34.29,36.2 | v33.02,38.1 34.29,38.1
  other vias: 55.88,27.94 53.34,22.86 49.53,29.21 54.61,5.08 53.98,9.53 30.48,12.7 29.21,11.43 36.2,9.53 42.55,6.99 62.23,38.1 62.23,33.02 45.72,40.64 16.51,46.99 22.86,43.18 17.78,43.18 25.4,38.1 13.97,33.02 13.97,60.96 57.15,63.5 54.61,43.18 36.83,2.54 38.1,6.35 26.67,6.35 12.7,15.24 22.86,15.24 19.05,8.89 5.08,3.81 21.59,3.81 30.48,2.54 13.97,3.81 3.81,67.31 15.24,67.31 54.61,67.31
  pour Top (isolate 0.406): -5.08,73.66 0,0 68.58,0 68.58,72.39
  pour Bottom (isolate 0.406): -3.81,0 66.04,0 66.04,69.85 -5.08,73.66
HDMI_HPD  (via drill 0.4)
  Top 0.254: R12.2 42.86,41.11 41.91,40.16 32.23,40.16 30.48,41.91 26.67,41.91 v25.4,43.18
  Top 0.61: R12.2 43.62,42.55 T1.1
  Bottom 0.254: J1.26 12.12,42.44 14.53,44.85 23.73,44.85 v25.4,43.18
HDMI_IN_HDMI_HPA  (via drill 0.4)
  Top 0.254: T3.3 40.05,4.8 R45.1 25.72,4.76 v21.59,8.89
  Bottom 0.254: v21.59,8.89 13.64,16.84 J1.58
HDMI_IN_HDMI_TX_5V  (via drill 0.4)
  Top 0.152: J4.18 52.99,12.51 v50.16,9.68 50.48,9.36 R31.2
  Top 0.254: R44.1 48.58,6.35 48.9,6.03 | R32.1 48.9,6.03 | 48.9,6.03 R31.2
  Bottom 0.152: v50.16,9.68 R36.2 R35.2
HDMI_IN_PRE
  Top 0.152: R40.1 41.91,25.19 IC2.7
  Top 0.61: R40.1 R41.2
HDMI_IN_RX0_N
  Top 0.152: IC2.35 42.98,15.09 43.7,15.09 arc-90 43.96,14.82 43.96,13.39 arc90 44.54,12.82 44.62,12.82 arc90 45.19,13.39 45.19,14.67 arc-90 45.46,14.94 45.55,14.94 arc-90 45.81,14.67 45.81,13.39 arc90 46.38,12.82 46.47,12.82 arc90 47.04,13.39 47.04,14.82 arc-90 47.31,15.09 48.96,15.09 50.39,16.52 52.93,16.52 53.72,17.31 54.13,17.31 54.43,17.01 J4.9
HDMI_IN_RX0_P
  Top 0.152: IC2.36 43.38,15.39 43.7,15.39 arc-90 44.27,14.82 44.27,13.39 arc90 44.54,13.12 44.62,13.12 arc90 44.89,13.39 44.89,14.82 arc-90 45.46,15.39 45.55,15.39 arc-90 46.12,14.82 46.12,13.39 arc90 46.38,13.12 46.47,13.12 arc90 46.74,13.39 46.74,14.82 arc-90 47.31,15.39 48.83,15.39 50.26,16.82 52.8,16.82 53.59,17.61 54.13,17.61 54.53,18.01 J4.7
HDMI_IN_RX1_N
  Top 0.152: IC2.38 43.83,16.36 46.42,16.36 48.96,18.9 49.53,18.9 arc-90 49.8,18.63 49.8,17.78 arc90 50.37,17.21 50.42,17.21 arc90 50.99,17.78 50.99,20.14 arc-90 51.26,20.4 51.31,20.4 arc-90 51.57,20.14 51.57,17.78 arc90 52.15,17.21 52.2,17.21 arc90 52.77,17.78 52.77,18.63 arc-90 53.03,18.9 53.66,18.9 54.05,18.51 J4.6
HDMI_IN_RX1_P
  Top 0.152: IC2.39 44.23,16.66 46.29,16.66 48.83,19.2 49.53,19.2 arc-90 50.1,18.63 50.1,17.78 arc90 50.37,17.51 50.42,17.51 arc90 50.69,17.78 50.69,20.32 arc-90 51.26,20.89 51.31,20.89 arc-90 51.88,20.32 51.88,17.78 arc90 52.15,17.51 52.2,17.51 arc90 52.46,17.78 52.46,18.63 arc-90 53.03,19.2 53.66,19.2 53.97,19.51 J4.4
HDMI_IN_RX2_N
  Top 0.152: IC2.1 42.72,21.75 43.43,21.75 44.7,20.48 47.53,20.48 48.48,21.44 48.73,21.44 arc90 49.3,22.01 49.3,23.9 arc-90 49.56,24.17 49.61,24.17 arc-90 49.88,23.9 49.88,22.01 arc90 50.45,21.44 50.5,21.44 arc90 51.07,22.01 51.07,23.9 arc-90 51.34,24.17 51.39,24.17 arc-90 51.66,23.9 51.66,22.01 arc90 52.23,21.44 52.48,21.44 53.59,20.33 54.13,20.33 54.45,20.01 J4.3
HDMI_IN_RX2_P
  Top 0.152: IC2.2 42.31,22.06 43.56,22.06 44.83,20.79 47.4,20.79 48.36,21.74 48.73,21.74 arc90 48.99,22.01 48.99,23.9 arc-90 49.56,24.48 49.61,24.48 arc-90 50.19,23.9 50.19,22.19 arc90 50.45,21.92 50.5,21.92 arc90 50.77,22.19 50.77,23.9 arc-90 51.34,24.48 51.39,24.48 arc-90 51.96,23.9 51.96,22.01 arc90 52.23,21.74 52.61,21.74 53.72,20.63 54.13,20.63 54.51,21.01 J4.1
HDMI_IN_RX_SCL  (via drill 0.4)
  Top 0.152: J4.15 50.2,14.01 45.88,9.68 v44.13,9.68 38.58,9.68 36.2,12.06 36.2,14.29 36.83,14.92 36.83,16.57 IC2.29
  Bottom 0.152: R36.1 v44.13,9.68
HDMI_IN_RX_SDA  (via drill 0.4)
  Top 0.152: J4.16 50.5,13.51 45.88,8.89 v43.18,8.89 38.58,8.89 35.72,11.75 35.72,14.45 36.35,15.08 36.35,16.81 IC2.28
  Bottom 0.152: R35.1 44.45,7.62 v43.18,8.89
HDMI_IN_RXC_N
  Top 0.152: IC2.32 40.17,15.78 40.17,15.3 39.22,14.35 39.22,11.68 40.26,10.64 46.1,10.64 51.34,15.88 54.13,15.88 54.51,15.51 J4.12
HDMI_IN_RXC_P
  Top 0.152: IC2.33 40.48,16.18 40.48,15.18 39.52,14.22 39.52,11.81 40.39,10.95 45.97,10.95 51.21,16.19 54.13,16.19 54.46,16.51 J4.10
HDMI_IN_TX0_N  (via drill 0.4)
  Top 0.152: v18.41,22.7 18.41,23.02 24.19,23.02 26.78,25.61 arc-90 27.16,25.61 27.72,25.04 arc90 28.53,25.04 28.53,25.04 arc90 28.53,25.85 27.96,26.42 arc-90 27.96,26.8 27.96,26.8 arc-90 28.34,26.8 28.91,26.23 arc90 29.72,26.23 29.72,26.23 arc90 29.72,27.04 29.15,27.61 arc-90 29.15,27.98 29.91,28.74 33.59,28.74 34.45,27.88 34.45,23.61 IC2.16
  Bottom 0.152: 18.41,23.02 v18.41,22.7 | R51.2 24.92,26.2 24.35,26.2 21.18,23.02 18.41,23.02 | J1.46 11.75,26.44 11.99,26.68 12.48,26.68 16.13,23.02 18.41,23.02
HDMI_IN_TX0_P  (via drill 0.4)
  Top 0.152: v18.41,23.65 18.41,23.33 24.07,23.33 26.56,25.82 arc-90 27.37,25.82 27.82,25.38 arc90 28.2,25.38 28.2,25.38 arc90 28.2,25.75 27.75,26.2 arc-90 27.75,27.01 27.75,27.01 arc-90 28.56,27.01 29.13,26.45 arc90 29.5,26.45 29.5,26.45 arc90 29.5,26.82 28.94,27.39 arc-90 28.94,28.2 29.78,29.05 33.72,29.05 34.76,28 34.76,24.01 IC2.15
  Bottom 0.152: R50.2 25.72,27.3 24.92,26.5 24.23,26.5 21.05,23.33 18.41,23.33 18.41,23.34 | J1.45 11.73,27.24 11.99,26.98 12.6,26.98 16.25,23.34 18.41,23.34 | v18.41,23.65 18.41,23.34
HDMI_IN_TX1_N  (via drill 0.4)
  Top 0.152: v16.51,24.29 16.51,24.61 23.88,24.61 28.96,29.69 34.23,29.69 35.41,28.51 35.41,24.78 IC2.13
  Bottom 0.152: 16.51,24.61 v16.51,24.29 | R49.2 24.92,30.49 23.4,30.49 21.27,28.35 21.27,26.77 19.11,24.61 16.51,24.61 | J1.44 11.76,28.04 11.99,28.26 13.43,28.26 15.09,26.61 15.09,25.34 15.81,24.61 16.51,24.61
HDMI_IN_TX1_P  (via drill 0.4)
  Top 0.152: v16.51,25.24 16.51,24.92 23.75,24.92 28.83,30 34.35,30 35.71,28.64 35.71,25.18 IC2.12
  Bottom 0.152: R48.2 24.76,30.79 23.27,30.79 20.96,28.48 20.96,26.89 18.99,24.92 16.51,24.92 | J1.43 11.71,28.84 11.99,28.57 13.56,28.57 15.39,26.73 15.39,25.46 15.93,24.92 16.51,24.92 | v16.51,25.24 16.51,24.92
HDMI_IN_TX2_N  (via drill 0.4)
  Top 0.152: v16.99,26.83 16.99,27.15 24.83,27.15 28.64,30.96 33.18,30.96 arc90 33.75,31.53 33.75,31.57 arc-90 34.02,31.83 34.06,31.83 arc-90 34.32,31.57 34.32,31.53 arc90 34.9,30.96 34.94,30.96 arc90 35.51,31.53 35.51,31.57 arc-90 35.77,31.83 35.81,31.83 arc-90 36.08,31.57 36.08,31.53 arc90 36.65,30.96 37.72,30.96 40.17,28.51 40.17,25.57 IC2.10
  Bottom 0.152: 16.99,27.15 v16.99,26.83 | R47.2 20.16,31.27 20.16,28.67 18.64,27.15 16.99,27.15 | J1.41 11.7,30.44 11.99,30.72 12.72,30.72 16.29,27.15 16.99,27.15
HDMI_IN_TX2_P  (via drill 0.4)
  Top 0.152: v16.99,27.78 16.99,27.46 24.7,27.46 28.51,31.27 33.18,31.27 arc90 33.45,31.53 33.45,31.57 arc-90 34.02,32.14 34.06,32.14 arc-90 34.63,31.57 arc90 34.9,31.3 34.94,31.3 arc90 35.2,31.57 arc-90 35.77,32.14 35.81,32.14 arc-90 36.39,31.57 36.39,31.53 arc90 36.65,31.27 37.85,31.27 40.48,28.64 40.48,25.17 IC2.9
  Bottom 0.152: R46.2 19.85,31.27 19.85,28.8 18.51,27.46 16.99,27.46 | J1.40 11.78,31.24 11.99,31.03 12.84,31.03 16.41,27.46 16.99,27.46 | v16.99,27.78 16.99,27.46
HDMI_IN_TX_SCL  (via drill 0.4)
  Top 0.152: IC2.22 33.72,18.41 32.38,18.41 31.11,19.68 22.86,19.68 arc-90 22.59,19.95 22.59,21.68 arc90 22.33,21.95 22.31,21.95 arc90 22.05,21.68 22.05,19.95 arc-90 21.78,19.68 21.76,19.68 arc-90 21.5,19.95 21.5,21.68 arc90 21.23,21.95 21.21,21.95 arc90 20.95,21.68 20.95,19.95 arc-90 20.68,19.68 20.67,19.68 arc-90 20.4,19.95 20.4,21.68 arc90 20.13,21.95 20.12,21.95 arc90 19.85,21.68 19.85,19.95 arc-90 19.58,19.68 19.57,19.68 arc-90 19.3,19.95 19.3,21.68 arc90 19.04,21.95 19.02,21.95 arc90 18.75,21.68 18.75,19.95 arc-90 18.49,19.68 18.47,19.68 arc-90 18.2,19.95 18.2,21.68 arc90 17.94,21.95 17.92,21.95 arc90 17.66,21.68 17.66,19.95 arc-90 17.39,19.68 v16.51,19.68
  Bottom 0.152: R42.2 v16.51,19.68 15.88,19.68 13.92,21.64 J1.52
HDMI_IN_TX_SDA  (via drill 0.4)
  Top 0.152: IC2.23 33.95,17.94 32.23,17.94 30.96,19.21 25.31,19.21 arc90 25.04,18.94 25.04,17.7 arc-90 24.77,17.43 24.76,17.43 arc-90 24.49,17.7 24.49,18.94 arc90 24.22,19.21 24.21,19.21 arc90 23.94,18.94 23.94,17.7 arc-90 23.68,17.43 23.66,17.43 arc-90 23.39,17.7 23.39,18.94 arc90 23.13,19.21 23.11,19.21 arc90 22.84,18.94 22.84,17.7 arc-90 22.58,17.43 22.56,17.43 arc-90 22.29,17.7 22.29,18.94 arc90 22.03,19.21 22.01,19.21 arc90 21.75,18.94 21.75,17.7 arc-90 21.48,17.43 21.46,17.43 arc-90 21.2,17.7 21.2,18.94 arc90 20.93,19.21 20.91,19.21 arc90 20.65,18.94 20.65,17.7 arc-90 20.38,17.43 20.36,17.43 arc-90 20.1,17.7 20.1,18.94 arc90 19.83,19.21 19.82,19.21 arc90 19.55,18.94 19.55,17.7 arc-90 19.28,17.43 19.27,17.43 arc-90 19,17.7 19,18.94 arc90 18.73,19.21 18.26,19.21 v16.51,17.46
  Bottom 0.152: R43.2 v16.51,17.46 15.56,17.46 12.18,20.84 J1.53
HDMI_IN_TXC_N  (via drill 0.4)
  Top 0.152: v23.65,21.11 23.65,21.44 24.38,21.44 arc-90 24.64,21.17 24.64,20.73 arc90 25.21,20.16 25.22,20.16 arc90 25.8,20.73 25.8,21.17 arc-90 26.06,21.44 26.07,21.44 arc-90 26.34,21.17 26.34,20.73 arc90 26.91,20.16 26.92,20.16 arc90 27.49,20.73 27.49,21.17 arc-90 27.75,21.44 27.76,21.44 arc-90 28.03,21.17 28.03,20.73 arc90 28.6,20.16 28.61,20.16 arc90 29.18,20.73 29.18,21.17 arc-90 29.45,21.44 29.84,21.44 arc90 30.42,22.01 30.42,22.86 arc90 29.84,23.43 26.77,23.43 arc-90 26.5,23.7 26.5,23.73 arc-90 26.77,24 29.84,24 arc90 30.42,24.57 30.42,24.99 arc-90 30.68,25.25 30.72,25.25 arc-90 30.98,24.99 30.98,22.01 arc90 31.56,21.44 31.97,21.44 32.61,22.07 33.87,22.07 IC2.19
  Bottom 0.152: R53.2 24.61,21.44 23.65,21.44 | 23.65,21.44 v23.65,21.11 | J1.48 11.74,24.84 11.99,25.09 12.8,25.09 16.45,21.44 23.65,21.44
HDMI_IN_TXC_P  (via drill 0.4)
  Top 0.152: v23.65,22.07 23.65,21.74 24.38,21.74 arc-90 24.95,21.17 24.95,20.73 arc90 25.21,20.47 25.22,20.47 arc90 25.49,20.73 25.49,21.17 arc-90 26.06,21.74 26.07,21.74 arc-90 26.64,21.17 26.64,20.9 arc90 26.91,20.63 26.92,20.63 arc90 27.18,20.9 27.18,21.17 arc-90 27.75,21.74 27.76,21.74 arc-90 28.34,21.17 28.34,20.73 arc90 28.6,20.47 28.61,20.47 arc90 28.88,20.73 28.88,21.17 arc-90 29.45,21.74 29.84,21.74 arc90 30.11,22.01 30.11,22.86 arc90 29.84,23.13 26.77,23.13 arc-90 26.19,23.7 26.19,23.73 arc-90 26.77,24.31 29.84,24.31 arc90 30.11,24.57 30.11,24.99 arc-90 30.68,25.56 30.72,25.56 arc-90 31.29,24.99 31.29,22.01 arc90 31.56,21.74 31.85,21.74 32.48,22.38 34.27,22.38 IC2.18
  Bottom 0.152: R52.2 24.61,21.74 23.65,21.74 | 23.65,21.74 v23.65,22.07 | J1.47 11.74,25.64 11.99,25.39 12.92,25.39 16.57,21.74 23.65,21.74
HDMI_TX_5V  (via drill 0.5)
  Top 0.152: v43.18,46.99 44.26,48.07 J2.18
  Bottom 0.61: R15.2 R18.2 40.96,44.77 v43.18,46.99
N$1
  Top 0.61: D1.A 62.66,65.29 R9.1
N$2  (via drill 0.6)
  Top 0.406: R3.1 15.24,40.01 14.61,39.37 | R4.1 15.24,38.73 14.61,39.37 | 14.61,39.37 3.17,39.37 v3.02,39.21
  Top 0.508: R3.1 16.19,40.96 16.51,40.64 R17.1
  Bottom 0.406: J1.90 3.04,39.24 v3.02,39.21
N$3
  Bottom 0.406: J1.29 12.1,40.04 13.34,41.27 13.34,41.91 14.29,42.86 R1.2
N$4  (via drill 0.6)
  Top 0.406: R3.2 14.29,42.86 12.06,40.64 3.17,40.64 v3.02,40.8
  Bottom 0.406: J1.89 3.77,40.04 v3.02,40.8
N$6
  Bottom 0.152: IC1.6 46.04,63.46 46.04,64.77 R5.2
N$7
  Bottom 0.152: R6.2 44.45,62.58 IC1.5
N$8  (via drill 0.4)
  Top 0.152: J2.13 59.14,50.57 v59.69,51.12
  Top 0.61: v59.69,60.96 59.69,61.28 59.26,61.71 D1.C
  Bottom 0.61: v59.69,51.12 v59.69,60.96
N$9
  Bottom 0.406: J1.30 14.47,39.24 | 14.47,39.24 15.24,40.01 R1.1 | R2.1 15.24,38.48 14.47,39.24
  Bottom 0.508: R2.1 16.19,37.78 16.51,38.1 R16.1
N$10
  Bottom 0.152: R19.2 33.02,51.44 34.61,53.02 35.6,53.02 IC1.25
  Bottom 0.406: R19.2 R20.1
N$12
  Top 0.61: R11.2 48.26,42.23 47.82,42.67 T1.3
N$13
  Top 0.178: 58.74,40.64
  Top 0.61: 58.74,40.64 R13.1 57.47,41.91 56.72,42.66 J2.S2 J2.S3 J2.S4 J2.S1 | C1.2 58.84,40.54 58.74,40.64
N$14  (via drill 0.4)
  Top 0.254: v32.15,53.5 32.15,55.48 v33.02,56.36
  Bottom 0.152: 35.63,56.59 IC1.30
  Bottom 0.203: v33.02,56.36 35.39,56.36 IC1.30
  Bottom 0.254: R14.1 31.67,53.02 v32.15,53.5
N$15
  Top 0.178: J2.19 53.6,47.57 52.07,46.04 R10.2
  Top 0.61: R10.2 R11.1
N$42
  Top 0.152: IC2.6 44.41,26.99 45.72,26.99 R29.2
N$43
  Top 0.61: D2.A 62.66,29.73 R30.1
N$44  (via drill 0.4)
  Top 0.152: J4.13 59.14,15.01 v59.69,15.56
  Top 0.61: v59.69,25.4 59.69,25.72 59.26,26.15 D2.C
  Bottom 0.61: v59.69,15.56 v59.69,25.4
N$45
  Top 0.178: 58.74,5.08
  Top 0.61: 58.74,5.08 R33.1 57.47,6.35 56.72,7.1 J4.S2 J4.S3 J4.S4 J4.S1 | C14.2 58.84,4.98 58.74,5.08
N$46  (via drill 0.4)
  Top 0.152: 37.54,16.58 IC2.30
  Top 0.254: R34.1 33.97,12.62 v34.61,13.26 | v37.31,14.29 37.31,16.34 IC2.30
  Bottom 0.254: v37.31,14.29 36.83,13.81 35.16,13.81 v34.61,13.26
N$47
  Top 0.152: T2.1 52.05,5.69 52.39,6.03 R31.1 52.38,10.32 54.08,12.01 J4.19
N$48  (via drill 0.4)
  Top 0.152: IC2.25 33.97,16.55 33.97,15.24 33.02,14.29 R38.1 | v28.57,12.7 R38.1 | R38.1 R37.2
N$49
  Top 0.152: R39.2 43.53,25.4 IC2.5
N$50
  Top 0.152: T2.3 48.96,2.79 R32.2
  Top 0.254: R32.2 45.92,2.86 LED1.C 44.97,3.06 T3.1
N$51
  Top 0.254: R44.2 44.77,5.51 LED1.A
PRE
  Bottom 0.152: R7.1 44.24,60.96 IC1.7
  Bottom 0.61: R7.1 R8.2
RX0_N
  Bottom 0.152: IC1.35 36.41,59.76 36.41,60.22 33.91,62.71 28.97,62.71 arc90 28.7,62.45 28.7,61.74 arc-90 28.13,61.17 28.01,61.17 arc-90 27.44,61.74 27.44,62.45 arc90 27.17,62.71 27.05,62.71 arc90 26.78,62.45 26.78,61.74 arc-90 26.21,61.17 26.09,61.17 arc-90 25.52,61.74 25.52,62.45 arc90 25.25,62.71 25.13,62.71 arc90 24.87,62.45 24.87,61.74 arc-90 24.3,61.17 24.17,61.17 arc-90 23.6,61.74 23.6,62.45 arc90 23.34,62.71 22.29,62.71 13.48,53.9 12.06,53.9 11.8,53.64 J1.12
RX0_P
  Bottom 0.152: IC1.36 36.94,59.94 36.94,60.12 34.04,63.02 28.97,63.02 arc90 28.4,62.45 28.4,61.74 arc-90 28.13,61.48 28.01,61.48 arc-90 27.74,61.74 27.74,62.45 arc90 27.17,63.02 27.05,63.02 arc90 26.48,62.45 26.48,61.83 arc-90 26.21,61.56 26.09,61.56 arc-90 25.82,61.83 25.82,62.45 arc90 25.25,63.02 25.13,63.02 arc90 24.56,62.45 24.56,61.74 arc-90 24.3,61.48 24.17,61.48 arc-90 23.91,61.74 23.91,62.45 arc90 23.34,63.02 22.16,63.02 13.35,54.21 12.06,54.21 11.83,54.44 J1.11
RX1_N
  Bottom 0.152: IC1.38 36.53,61.76 36.13,61.76 33.27,64.62 32.41,64.62 arc90 32.14,64.35 32.14,64.06 arc-90 31.57,63.49 31.35,63.49 arc-90 30.78,64.06 30.78,64.35 arc90 30.51,64.62 30.28,64.62 arc90 30.02,64.35 30.02,64.06 arc-90 29.45,63.49 29.22,63.49 arc-90 28.65,64.06 28.65,64.35 arc90 28.38,64.62 28.16,64.62 arc90 27.89,64.35 27.89,64.06 arc-90 27.32,63.49 27.09,63.49 arc-90 26.52,64.06 26.52,64.35 arc90 26.26,64.62 26.03,64.62 arc90 25.77,64.35 25.77,64.06 arc-90 25.19,63.49 24.97,63.49 arc-90 24.4,64.06 24.4,64.35 arc90 24.13,64.62 22.92,64.62 14.59,56.28 11.99,56.28 11.74,56.04 J1.9
RX1_P
  Bottom 0.152: IC1.39 36.93,62.06 36.26,62.06 33.4,64.92 32.41,64.92 arc90 31.84,64.35 31.84,64.06 arc-90 31.57,63.8 31.35,63.8 arc-90 31.08,64.06 31.08,64.35 arc90 30.51,64.92 30.28,64.92 arc90 29.71,64.35 29.71,64.23 arc-90 29.45,63.96 29.22,63.96 arc-90 28.95,64.23 28.95,64.35 arc90 28.38,64.92 28.16,64.92 arc90 27.59,64.35 27.59,64.06 arc-90 27.32,63.8 27.09,63.8 arc-90 26.83,64.06 26.83,64.35 arc90 26.26,64.92 26.03,64.92 arc90 25.46,64.35 25.46,64.06 arc-90 25.19,63.8 24.97,63.8 arc-90 24.7,64.06 24.7,64.35 arc90 24.13,64.92 22.8,64.92 14.46,56.59 11.99,56.59 11.73,56.84 J1.8
RX2_N
  Bottom 0.152: IC1.1 40.8,61.77 40.8,62.48 39.85,63.44 39.85,65.02 38.67,66.2 21.97,66.2 13.64,57.87 11.99,57.87 11.76,57.64 J1.7
RX2_P
  Bottom 0.152: IC1.2 41.11,61.37 41.11,62.61 40.16,63.56 40.16,65.15 38.8,66.51 21.84,66.51 13.51,58.18 11.99,58.18 11.72,58.44 J1.6
RX_SCL  (via drill 0.4)
  Top 0.254: R21.2 v21.59,55.24
  Bottom 0.152: 14.61,48.9 20.95,55.24 v21.59,55.24
  Bottom 0.178: v21.59,55.24 25.24,55.24 arc90 25.52,55.52 25.52,56.25 arc-90 25.8,56.53 25.81,56.53 arc-90 26.09,56.25 26.09,55.52 arc90 26.37,55.24 26.38,55.24 arc90 26.65,55.52 26.65,56.25 arc-90 26.93,56.53 26.94,56.53 arc-90 27.22,56.25 27.22,55.52 arc90 27.5,55.24 27.51,55.24 arc90 27.79,55.52 27.79,56.25 arc-90 28.07,56.53 28.08,56.53 arc-90 28.36,56.25 28.36,55.52 arc90 28.63,55.24 28.64,55.24 arc90 28.92,55.52 28.92,56.25 arc-90 29.2,56.53 29.21,56.53 arc-90 29.49,56.25 29.49,55.52 arc90 29.77,55.24 33.42,55.24 33.89,55.72 35.47,55.72 IC1.29 | J1.20 12.95,47.24 14.61,48.9
RX_SDA  (via drill 0.4)
  Top 0.254: R22.2 v24.13,54.37
  Bottom 0.152: v24.13,54.37 21.35,54.37 20.02,53.04 arc90 20.02,52.66 20.41,52.27 arc-90 20.41,51.89 20.39,51.86 arc-90 20.01,51.86 19.62,52.26 arc90 19.24,52.26 19.21,52.23 arc90 19.21,51.86 19.61,51.46 arc-90 19.61,51.08 19.59,51.06 arc-90 19.21,51.06 18.81,51.46 arc90 18.44,51.46 18.41,51.43 arc90 18.41,51.05 18.81,50.66 arc-90 18.81,50.28 18.78,50.26 arc-90 18.41,50.26 18.01,50.65 arc90 17.63,50.65 17.61,50.63 arc90 17.61,50.25 18,49.85 arc-90 18,49.48 17.98,49.45 arc-90 17.6,49.45 17.2,49.85 arc90 16.83,49.85 15,48.02
  Bottom 0.178: IC1.28 35.78,55.32 34.13,55.32 33.18,54.37 v24.13,54.37 | 15,48.02 13.42,46.44 J1.21
RXC_N
  Bottom 0.152: IC1.32 35.14,58.9 33.39,58.9 arc90 33.12,58.64 33.12,57.81 arc-90 32.55,57.23 32.46,57.23 arc-90 31.89,57.81 31.89,58.64 arc90 31.62,58.9 31.53,58.9 arc90 31.26,58.64 31.26,57.81 arc-90 30.69,57.23 30.59,57.23 arc-90 30.02,57.81 30.02,58.64 arc90 29.76,58.9 29.66,58.9 arc90 29.4,58.64 29.4,57.81 arc-90 28.83,57.23 28.73,57.23 arc-90 28.16,57.81 28.16,58.64 arc90 27.9,58.9 27.8,58.9 arc90 27.54,58.64 27.54,57.81 arc-90 26.97,57.23 26.87,57.23 arc-90 26.3,57.81 26.3,58.64 arc90 26.04,58.9 21.34,58.9 14.75,52.31 11.99,52.31 11.71,52.04 J1.14
RXC_P
  Bottom 0.152: IC1.33 35.55,59.21 33.39,59.21 arc90 32.82,58.64 32.82,57.81 arc-90 32.55,57.54 32.46,57.54 arc-90 32.19,57.81 32.19,58.64 arc90 31.62,59.21 31.53,59.21 arc90 30.95,58.64 30.95,57.96 arc-90 30.69,57.7 30.59,57.7 arc-90 30.33,57.96 30.33,58.64 arc90 29.76,59.21 29.66,59.21 arc90 29.09,58.64 29.09,57.81 arc-90 28.83,57.54 28.73,57.54 arc-90 28.47,57.81 28.47,58.64 arc90 27.9,59.21 27.8,59.21 arc90 27.23,58.64 27.23,57.81 arc-90 26.97,57.54 26.87,57.54 arc-90 26.61,57.81 26.61,58.64 arc90 26.04,59.21 21.21,59.21 14.62,52.62 11.99,52.62 11.77,52.84 J1.13
TX0_N  (via drill 0.4)
  Top 0.152: J2.9 54.27,52.57 53.98,52.87 52.39,52.87 v52.39,52.55
  Bottom 0.152: v52.39,52.55 52.39,52.87 51.59,52.87 arc90 51.32,52.6 51.32,52.58 arc-90 50.75,52 50.46,52 arc-90 49.89,52.58 49.89,53.32 arc90 49.62,53.59 49.33,53.59 arc90 49.07,53.32 49.07,52.58 arc-90 48.5,52 48.21,52 arc-90 47.64,52.58 47.64,52.6 arc90 47.37,52.87 47.24,52.87 46.61,53.51 42.66,53.51 IC1.16
TX0_P  (via drill 0.4)
  Top 0.152: J2.7 54.37,53.57 53.98,53.17 52.39,53.17 v52.39,53.5
  Bottom 0.152: v52.39,53.5 52.39,53.17 51.59,53.17 arc90 51.01,52.6 51.01,52.58 arc-90 50.75,52.31 50.46,52.31 arc-90 50.19,52.58 50.19,53.47 arc90 49.62,54.04 49.33,54.04 arc90 48.76,53.47 48.76,52.58 arc-90 48.5,52.31 48.21,52.31 arc-90 47.94,52.58 47.94,52.6 arc90 47.37,53.17 46.74,53.81 43.06,53.81 IC1.15
TX1_N  (via drill 0.4)
  Top 0.152: J2.6 54.05,54.07 53.66,54.46 52.78,54.46 arc-90 52.21,55.03 52.21,55.74 arc90 51.94,56 51.92,56 arc90 51.66,55.74 51.66,55.03 arc-90 51.09,54.46 51.07,54.46 arc-90 50.5,55.03 50.5,55.55 arc90 50.23,55.82 50.21,55.82 arc90 49.94,55.55 49.94,55.03 arc-90 49.37,54.46 49.12,54.46 48.72,54.06 48.02,54.06 v48.02,53.74
  Bottom 0.152: v48.02,53.74 48.02,54.06 47.24,54.06 47.01,54.3 43.99,54.3 IC1.13
TX1_P  (via drill 0.4)
  Top 0.152: J2.4 53.97,55.07 53.66,54.76 52.78,54.76 arc-90 52.52,55.03 52.52,55.74 arc90 51.94,56.31 51.92,56.31 arc90 51.35,55.74 51.35,55.03 arc-90 51.09,54.76 51.07,54.76 arc-90 50.8,55.03 50.8,55.74 arc90 50.23,56.31 50.21,56.31 arc90 49.64,55.74 49.64,55.03 arc-90 49.37,54.76 48.99,54.76 48.59,54.37 48.02,54.37 v48.02,54.69
  Bottom 0.152: v48.02,54.69 48.02,54.37 47.37,54.37 47.13,54.6 44.39,54.6 IC1.12
TX2_N  (via drill 0.4)
  Top 0.152: J2.3 54.45,55.57 53.98,56.05 53.34,56.05 v53.34,55.72
  Bottom 0.152: v53.34,55.72 53.34,56.05 50.42,56.05 50.04,56.42 arc-90 50.04,57.23 50.46,57.65 arc90 50.46,58.03 50.43,58.06 arc90 50.05,58.06 49.63,57.64 arc-90 48.82,57.64 48.78,57.68 arc-90 48.78,58.49 49.2,58.91 arc90 49.2,59.29 49.17,59.32 arc90 48.79,59.32 48.37,58.9 arc-90 47.56,58.9 44.3,58.9 IC1.10
TX2_P  (via drill 0.4)
  Top 0.152: J2.1 54.2,56.57 53.98,56.35 53.34,56.35 v53.34,56.67
  Bottom 0.152: v53.34,56.67 53.34,56.35 50.55,56.35 50.26,56.64 arc-90 50.26,57.01 50.68,57.44 arc90 50.68,58.24 50.64,58.28 arc90 49.83,58.28 49.49,57.94 arc-90 49.12,57.94 49.08,57.98 arc-90 49.08,58.35 49.42,58.69 arc90 49.42,59.5 49.38,59.54 arc90 48.58,59.54 48.16,59.12 arc-90 47.78,59.12 47.69,59.21 43.9,59.21 IC1.9
TX_SCL  (via drill 0.5)
  Top 0.152: J2.15 39.33,49.57 v38.73,50.16
  Bottom 0.152: IC1.22 38.1,53.41 38.1,50.8 v38.73,50.16 39.37,49.53 R18.1
TX_SDA  (via drill 0.5)
  Top 0.152: J2.16 37.92,49.07 v37.15,49.85
  Bottom 0.152: IC1.23 37.15,53.16 v37.15,49.85 37.15,48.9 36.83,48.58 R15.1
TXC_N  (via drill 0.4)
  Top 0.152: J2.12 54.19,51.07 53.98,51.28 53.34,51.28 v53.34,50.96
  Bottom 0.152: v53.34,50.96 53.34,51.28 52.77,51.28 51.18,49.7 42.8,49.7 41.44,51.05 41.44,52.6 IC1.19
TXC_P  (via drill 0.4)
  Top 0.152: J2.10 54.46,52.07 53.98,51.59 53.34,51.59 v53.34,51.91
  Bottom 0.152: v53.34,51.91 53.34,51.59 52.64,51.59 51.05,50 42.93,50 41.74,51.18 41.74,53.01 IC1.18